# Altium project GatorSynth_Step_Sequencer.PrjPcb (part 1 of 2)
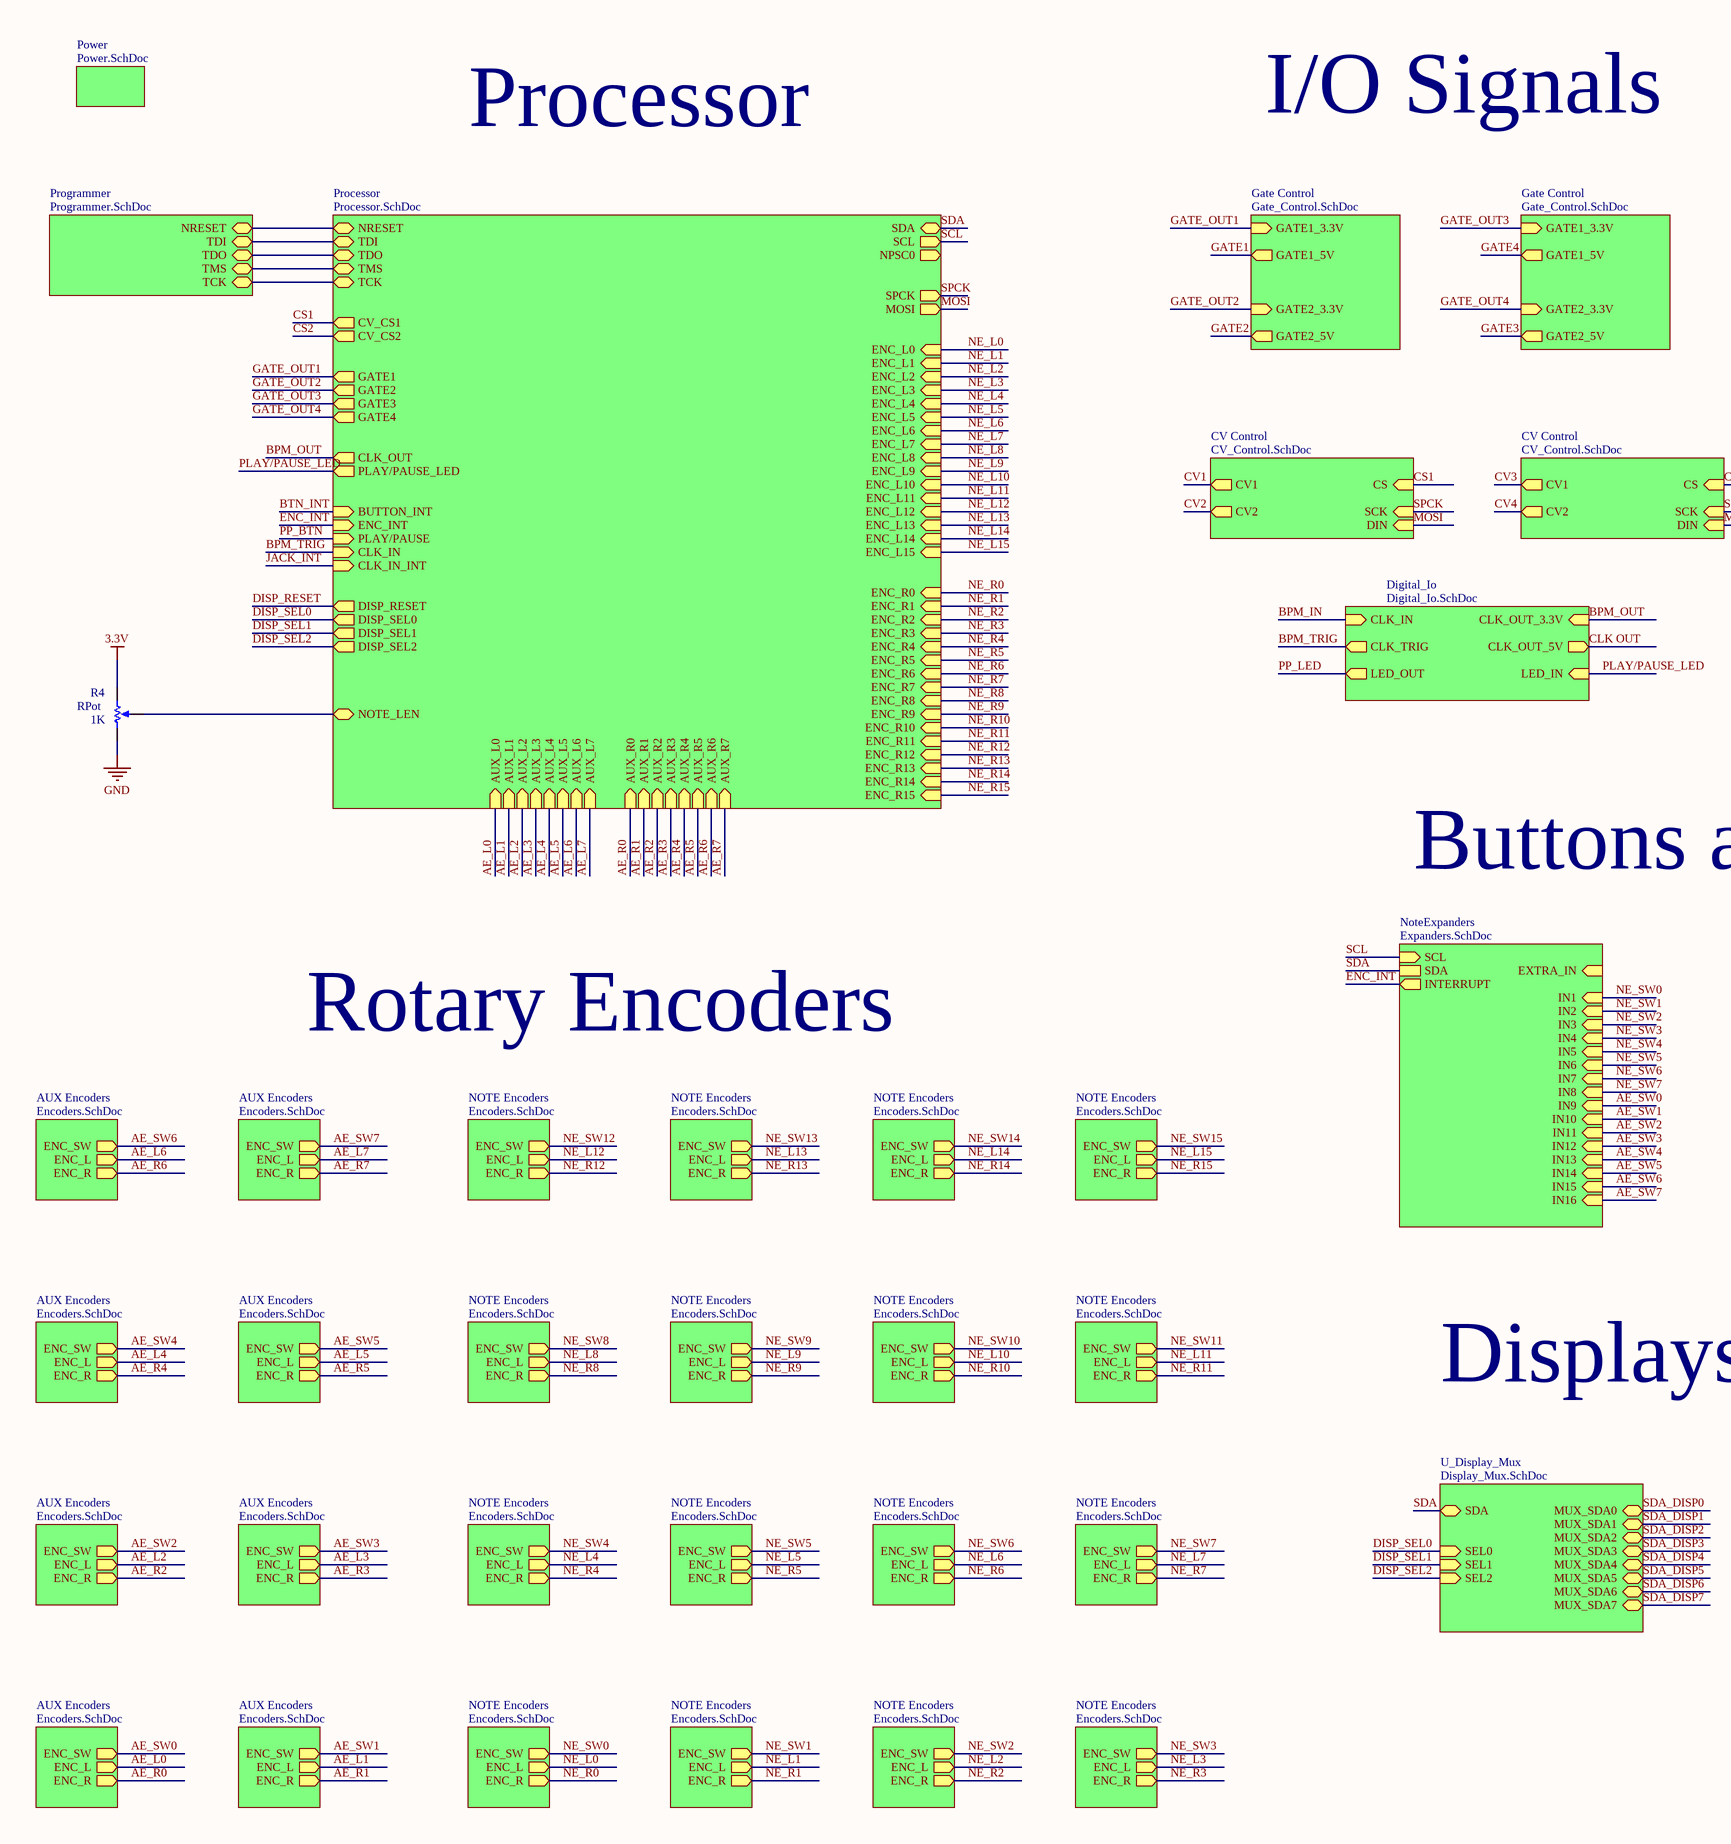
[diagram p0: Top_Level.SchDoc, left]
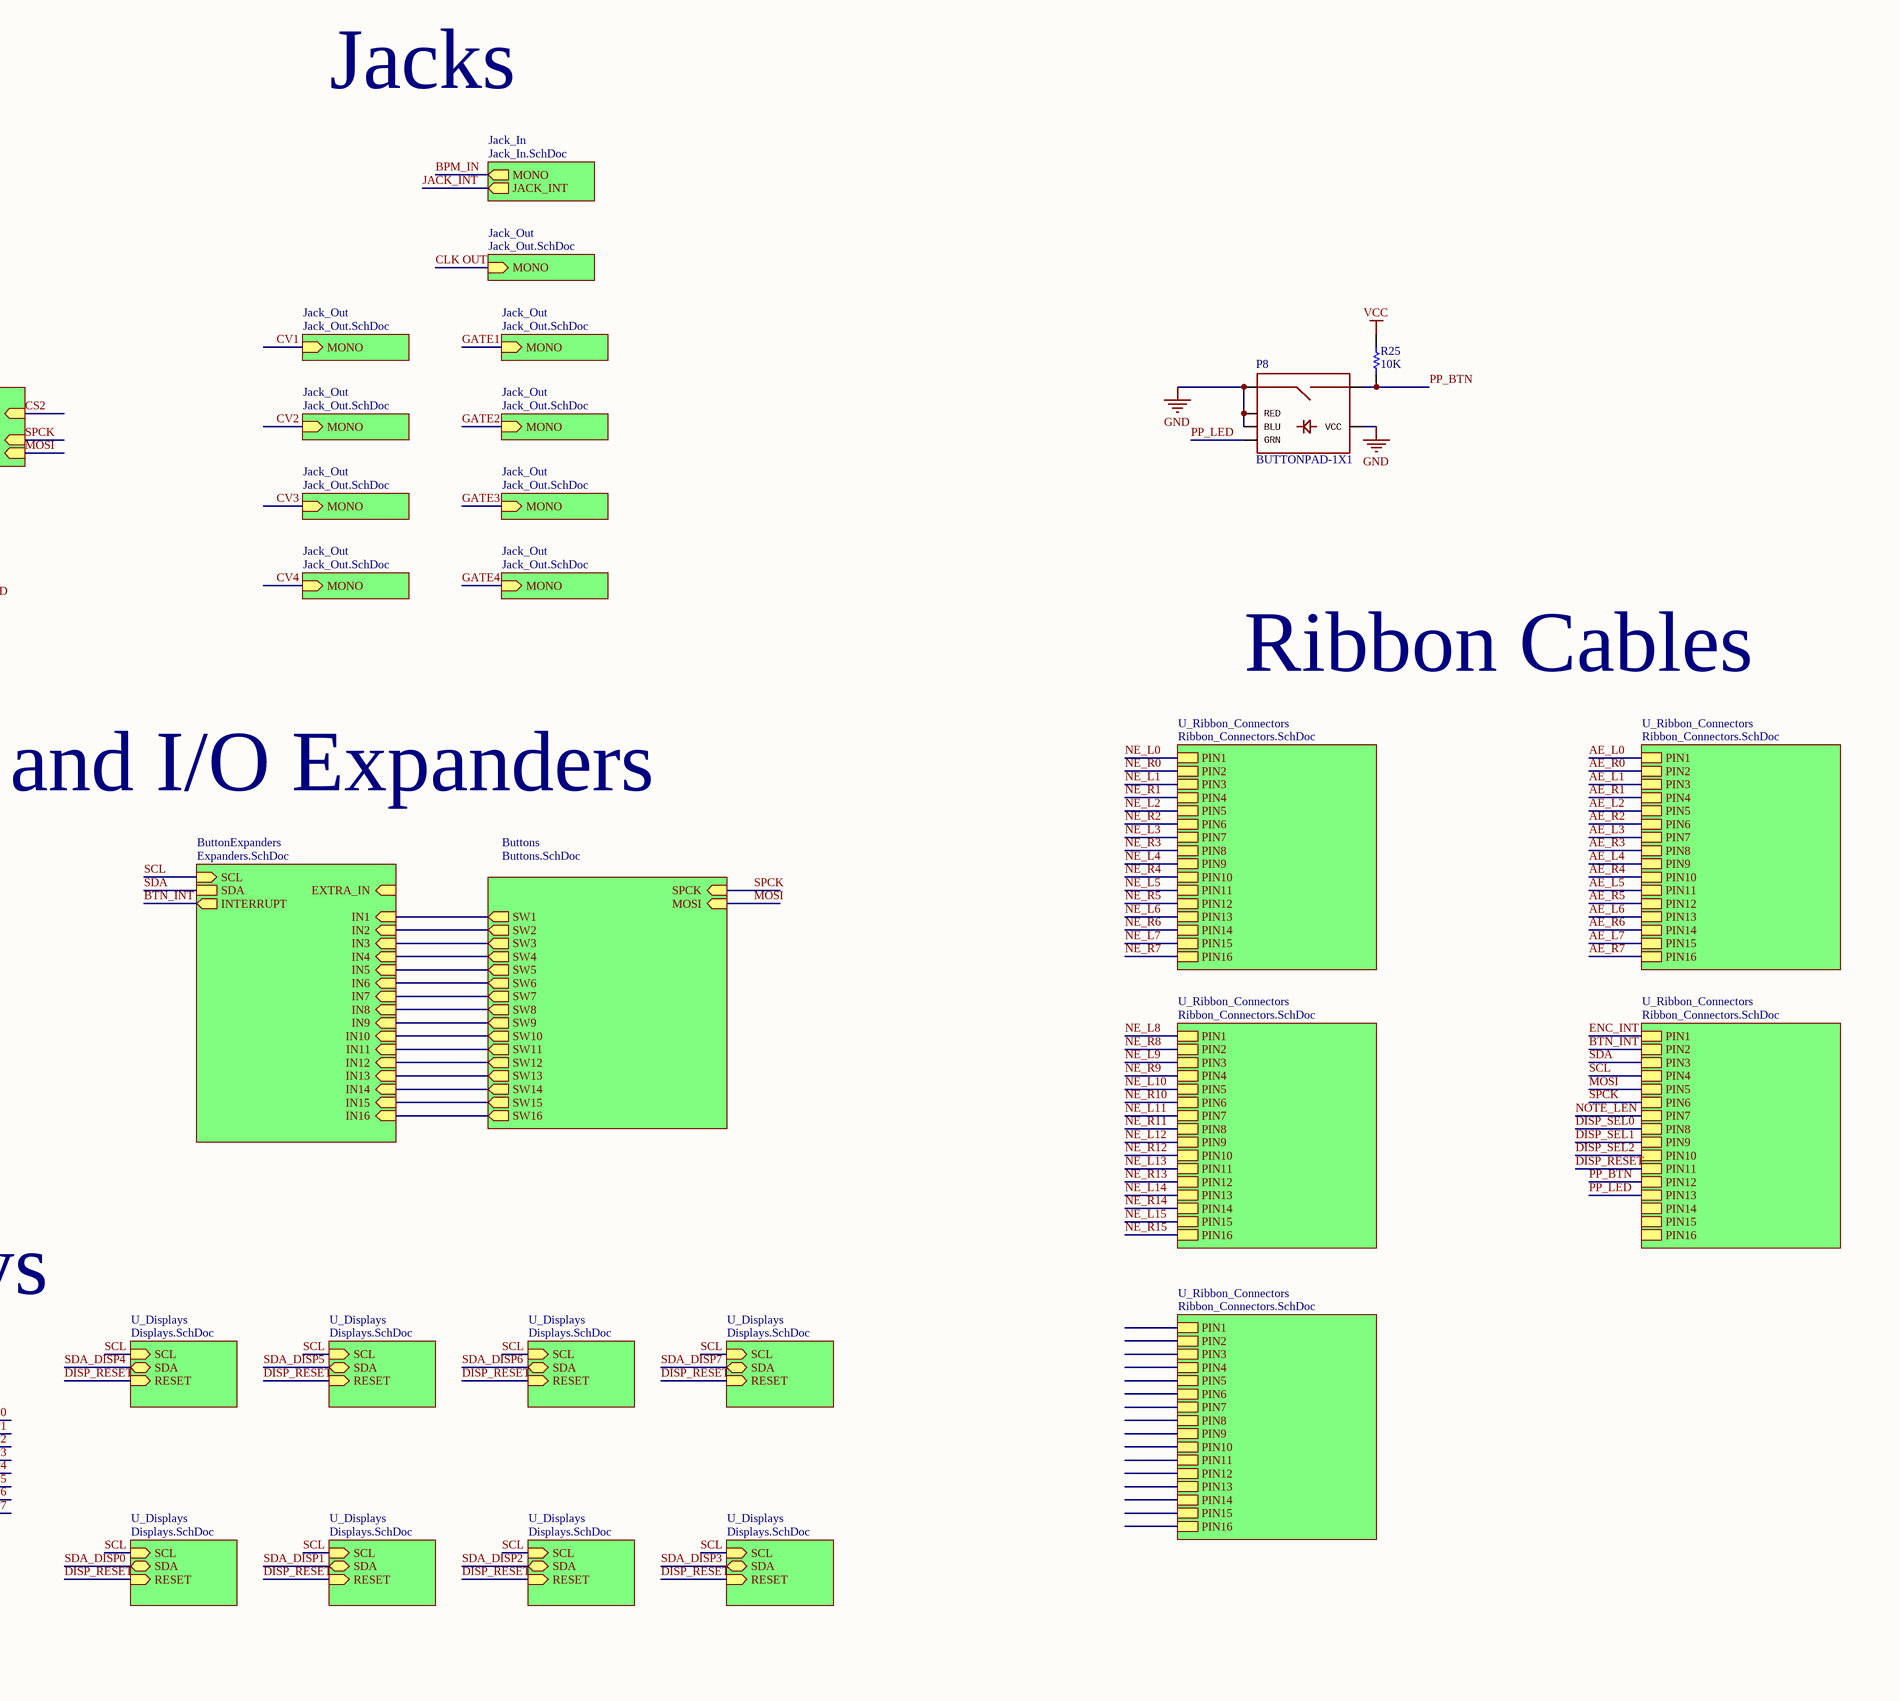
[diagram p1: Top_Level.SchDoc, right]
13 sheets, 398 parts. Net scope: hierarchical (ports join the sheet entries above them; power ports are global).
Board file: Gatorsynth_Sequencer.PcbDoc
Sheets:
  Top_Level.SchDoc
    Programmer = Programmer.SchDoc
    Gate Control = Gate_Control.SchDoc
    Processor = Processor.SchDoc
    Buttons = Buttons.SchDoc
    Jack_In = Jack_In.SchDoc
    Digital_Io = Digital_Io.SchDoc
    ButtonExpanders = Expanders.SchDoc
    NoteExpanders = Expanders.SchDoc
    Power = Power.SchDoc
    AUX Encoders = Encoders.SchDoc
    AUX Encoders = Encoders.SchDoc
    AUX Encoders = Encoders.SchDoc
    AUX Encoders = Encoders.SchDoc
    AUX Encoders = Encoders.SchDoc
    AUX Encoders = Encoders.SchDoc
    AUX Encoders = Encoders.SchDoc
    AUX Encoders = Encoders.SchDoc
    NOTE Encoders = Encoders.SchDoc
    NOTE Encoders = Encoders.SchDoc
    NOTE Encoders = Encoders.SchDoc
    NOTE Encoders = Encoders.SchDoc
    NOTE Encoders = Encoders.SchDoc
    NOTE Encoders = Encoders.SchDoc
    NOTE Encoders = Encoders.SchDoc
    NOTE Encoders = Encoders.SchDoc
    NOTE Encoders = Encoders.SchDoc
    NOTE Encoders = Encoders.SchDoc
    NOTE Encoders = Encoders.SchDoc
    NOTE Encoders = Encoders.SchDoc
    NOTE Encoders = Encoders.SchDoc
    NOTE Encoders = Encoders.SchDoc
    NOTE Encoders = Encoders.SchDoc
    NOTE Encoders = Encoders.SchDoc
    U_Displays = Displays.SchDoc
    U_Displays = Displays.SchDoc
    U_Displays = Displays.SchDoc
    U_Displays = Displays.SchDoc
    U_Displays = Displays.SchDoc
    U_Displays = Displays.SchDoc
    U_Displays = Displays.SchDoc
    U_Displays = Displays.SchDoc
    Gate Control = Gate_Control.SchDoc
    CV Control = CV_Control.SchDoc
    CV Control = CV_Control.SchDoc
    Jack_Out = Jack_Out.SchDoc
    Jack_Out = Jack_Out.SchDoc
    Jack_Out = Jack_Out.SchDoc
    Jack_Out = Jack_Out.SchDoc
    Jack_Out = Jack_Out.SchDoc
    Jack_Out = Jack_Out.SchDoc
    Jack_Out = Jack_Out.SchDoc
    Jack_Out = Jack_Out.SchDoc
    Jack_Out = Jack_Out.SchDoc

## Sheet Top_Level.SchDoc
size D

### Parts
(Parts that share a designator on the sheet are numbered #1, #2 ... from top to bottom, then left to right.)
P8#1  BUTTONPAD-1X1  [BUTTONPAD-1X1]
R4  RPot  value 1K  [POT inline wide]
R25#1  value 10K  [AXIAL-0.3]  (hidden comment: R3)

### Sub-sheets
AUX Encoders = Encoders.SchDoc: ENC_SW (out), ENC_L (out), ENC_R (out)
AUX Encoders = Encoders.SchDoc: ENC_SW (out), ENC_L (out), ENC_R (out)
AUX Encoders = Encoders.SchDoc: ENC_SW (out), ENC_L (out), ENC_R (out)
AUX Encoders = Encoders.SchDoc: ENC_SW (out), ENC_L (out), ENC_R (out)
AUX Encoders = Encoders.SchDoc: ENC_SW (out), ENC_L (out), ENC_R (out)
AUX Encoders = Encoders.SchDoc: ENC_SW (out), ENC_L (out), ENC_R (out)
AUX Encoders = Encoders.SchDoc: ENC_SW (out), ENC_L (out), ENC_R (out)
AUX Encoders = Encoders.SchDoc: ENC_SW (out), ENC_L (out), ENC_R (out)
ButtonExpanders = Expanders.SchDoc: SCL (in), SDA, EXTRA_IN (in), INTERRUPT (out), IN1 (in), IN2 (in), IN3 (in), IN4 (in), IN5 (in), IN6 (in), IN7 (in), IN8 (in), IN9 (in), IN10 (in), IN11 (in), IN12 (in), IN13 (in), IN14 (in), IN15 (in), IN16 (in)
Buttons = Buttons.SchDoc: SPCK (in), MOSI (in), SW1 (out), SW2 (out), SW3 (out), SW4 (out), SW5 (out), SW6 (out), SW7 (out), SW8 (out), SW9 (out), SW10 (out), SW11 (out), SW12 (out), SW13 (out), SW14 (out), SW15 (out), SW16 (out)
CV Control = CV_Control.SchDoc: CS (in), SCK (in), DIN (in), CV1 (out), CV2 (out)
CV Control = CV_Control.SchDoc: CS (in), SCK (in), DIN (in), CV1 (out), CV2 (out)
Digital_Io = Digital_Io.SchDoc: CLK_IN (in), CLK_TRIG (out), LED_IN (in), CLK_OUT_3.3V (in), CLK_OUT_5V (out), LED_OUT (out)
Gate Control = Gate_Control.SchDoc: GATE1_3.3V (in), GATE2_3.3V (in), GATE1_5V (out), GATE2_5V (out)
Gate Control = Gate_Control.SchDoc: GATE1_3.3V (in), GATE2_3.3V (in), GATE1_5V (out), GATE2_5V (out)
Jack_In = Jack_In.SchDoc: MONO (out), JACK_INT (out)
Jack_Out = Jack_Out.SchDoc: MONO (in)
Jack_Out = Jack_Out.SchDoc: MONO (in)
Jack_Out = Jack_Out.SchDoc: MONO (in)
Jack_Out = Jack_Out.SchDoc: MONO (in)
Jack_Out = Jack_Out.SchDoc: MONO (in)
Jack_Out = Jack_Out.SchDoc: MONO (in)
Jack_Out = Jack_Out.SchDoc: MONO (in)
Jack_Out = Jack_Out.SchDoc: MONO (in)
Jack_Out = Jack_Out.SchDoc: MONO (in)
NOTE Encoders = Encoders.SchDoc: ENC_SW (out), ENC_L (out), ENC_R (out)
NOTE Encoders = Encoders.SchDoc: ENC_SW (out), ENC_L (out), ENC_R (out)
NOTE Encoders = Encoders.SchDoc: ENC_SW (out), ENC_L (out), ENC_R (out)
NOTE Encoders = Encoders.SchDoc: ENC_SW (out), ENC_L (out), ENC_R (out)
NOTE Encoders = Encoders.SchDoc: ENC_SW (out), ENC_L (out), ENC_R (out)
NOTE Encoders = Encoders.SchDoc: ENC_SW (out), ENC_L (out), ENC_R (out)
NOTE Encoders = Encoders.SchDoc: ENC_SW (out), ENC_L (out), ENC_R (out)
NOTE Encoders = Encoders.SchDoc: ENC_SW (out), ENC_L (out), ENC_R (out)
NOTE Encoders = Encoders.SchDoc: ENC_SW (out), ENC_L (out), ENC_R (out)
NOTE Encoders = Encoders.SchDoc: ENC_SW (out), ENC_L (out), ENC_R (out)
NOTE Encoders = Encoders.SchDoc: ENC_SW (out), ENC_L (out), ENC_R (out)
NOTE Encoders = Encoders.SchDoc: ENC_SW (out), ENC_L (out), ENC_R (out)
NOTE Encoders = Encoders.SchDoc: ENC_SW (out), ENC_L (out), ENC_R (out)
NOTE Encoders = Encoders.SchDoc: ENC_SW (out), ENC_L (out), ENC_R (out)
NOTE Encoders = Encoders.SchDoc: ENC_SW (out), ENC_L (out), ENC_R (out)
NOTE Encoders = Encoders.SchDoc: ENC_SW (out), ENC_L (out), ENC_R (out)
NoteExpanders = Expanders.SchDoc: SCL (in), SDA, EXTRA_IN (in), INTERRUPT (out), IN1 (in), IN2 (in), IN3 (in), IN4 (in), IN5 (in), IN6 (in), IN7 (in), IN8 (in), IN9 (in), IN10 (in), IN11 (in), IN12 (in), IN13 (in), IN14 (in), IN15 (in), IN16 (in)
Power = Power.SchDoc: no entries
Processor = Processor.SchDoc: MOSI (out), SPCK (out), NPSC0 (out), SDA (bidir), SCL (out), NRESET (bidir), TDI (bidir), TDO (bidir), TMS (bidir), TCK (bidir), GATE1 (out), GATE2 (out), GATE3 (out), GATE4 (out), BUTTON_INT (in), ENC_INT (in), PLAY/PAUSE (in), CLK_IN (in), CLK_IN_INT (in), CLK_OUT (out), DISP_RESET (out), PLAY/PAUSE_LED (out), CV_CS2 (out), CV_CS1 (out), AUX_L0 (in), AUX_L1 (in), AUX_L2 (in), AUX_L3 (in), AUX_L4 (in), AUX_L5 (in), AUX_L6 (in), AUX_L7 (in), AUX_R0 (in), AUX_R1 (in), AUX_R2 (in), AUX_R3 (in), AUX_R4 (in), AUX_R5 (in), AUX_R6 (in), AUX_R7 (in), DISP_SEL0 (out), DISP_SEL1 (out), DISP_SEL2 (out), ENC_L0 (in), ENC_L1 (in), ENC_L2 (in), ENC_L3 (in), ENC_L4 (in), ENC_L5 (in), ENC_L6 (in), ENC_L7 (in), ENC_L8 (in), ENC_L9 (in), ENC_L10 (in), ENC_L11 (in), ENC_L12 (in), ENC_L13 (in), ENC_L14 (in), ENC_L15 (in), ENC_R0 (in), ENC_R1 (in), ENC_R2 (in), ENC_R3 (in), ENC_R4 (in), ENC_R5 (in), ENC_R6 (in), ENC_R7 (in), ENC_R8 (in), ENC_R9 (in), ENC_R10 (in), ENC_R11 (in), ENC_R12 (in), ENC_R13 (in), ENC_R14 (in), ENC_R15 (in), NOTE_LEN
Programmer = Programmer.SchDoc: TMS (bidir), TCK (bidir), TDO (bidir), TDI (bidir), NRESET (bidir)
U_Display_Mux = Display_Mux.SchDoc (file not in this document): SEL1 (in), SEL2 (in), MUX_SDA0 (bidir), MUX_SDA1 (bidir), MUX_SDA2 (bidir), MUX_SDA3 (bidir), MUX_SDA4 (bidir), MUX_SDA5 (bidir), MUX_SDA6 (bidir), MUX_SDA7 (bidir), SDA (bidir), SEL0 (in)
U_Displays = Displays.SchDoc: SCL (in), SDA (bidir), RESET (in)
U_Displays = Displays.SchDoc: SCL (in), SDA (bidir), RESET (in)
U_Displays = Displays.SchDoc: SCL (in), SDA (bidir), RESET (in)
U_Displays = Displays.SchDoc: SCL (in), SDA (bidir), RESET (in)
U_Displays = Displays.SchDoc: SCL (in), SDA (bidir), RESET (in)
U_Displays = Displays.SchDoc: SCL (in), SDA (bidir), RESET (in)
U_Displays = Displays.SchDoc: SCL (in), SDA (bidir), RESET (in)
U_Displays = Displays.SchDoc: SCL (in), SDA (bidir), RESET (in)
U_Ribbon_Connectors = Ribbon_Connectors.SchDoc (file not in this document): PIN1, PIN2, PIN3, PIN4, PIN5, PIN6, PIN7, PIN8, PIN9, PIN10, PIN11, PIN12, PIN13, PIN14, PIN15, PIN16
U_Ribbon_Connectors = Ribbon_Connectors.SchDoc (file not in this document): PIN1, PIN2, PIN3, PIN4, PIN5, PIN6, PIN7, PIN8, PIN9, PIN10, PIN11, PIN12, PIN13, PIN14, PIN15, PIN16
U_Ribbon_Connectors = Ribbon_Connectors.SchDoc (file not in this document): PIN1, PIN2, PIN3, PIN4, PIN5, PIN6, PIN7, PIN8, PIN9, PIN10, PIN11, PIN12, PIN13, PIN14, PIN15, PIN16
U_Ribbon_Connectors = Ribbon_Connectors.SchDoc (file not in this document): PIN1, PIN2, PIN3, PIN4, PIN5, PIN6, PIN7, PIN8, PIN9, PIN10, PIN11, PIN12, PIN13, PIN14, PIN15, PIN16
U_Ribbon_Connectors = Ribbon_Connectors.SchDoc (file not in this document): PIN1, PIN2, PIN3, PIN4, PIN5, PIN6, PIN7, PIN8, PIN9, PIN10, PIN11, PIN12, PIN13, PIN14, PIN15, PIN16

### Nets
3.3V: R4.2(BOT)
GND: P8#1.BLU1(BLU) P8#1.RED1(RED) P8#1.SIG1 P8#1.VCC1(VCC) R4.1(TOP)
VCC: R25#1.2
AE_L0: sheet Processor/AUX_L0, sheet AUX Encoders/ENC_L, sheet U_Ribbon_Connectors/PIN1
AE_L1: sheet Processor/AUX_L1, sheet AUX Encoders/ENC_L, sheet U_Ribbon_Connectors/PIN3
AE_L2: sheet Processor/AUX_L2, sheet AUX Encoders/ENC_L, sheet U_Ribbon_Connectors/PIN5
AE_L3: sheet Processor/AUX_L3, sheet AUX Encoders/ENC_L, sheet U_Ribbon_Connectors/PIN7
AE_L4: sheet Processor/AUX_L4, sheet AUX Encoders/ENC_L, sheet U_Ribbon_Connectors/PIN9
AE_L5: sheet Processor/AUX_L5, sheet AUX Encoders/ENC_L, sheet U_Ribbon_Connectors/PIN11
AE_L6: sheet Processor/AUX_L6, sheet AUX Encoders/ENC_L, sheet U_Ribbon_Connectors/PIN13
AE_L7: sheet Processor/AUX_L7, sheet AUX Encoders/ENC_L, sheet U_Ribbon_Connectors/PIN15
AE_R0: sheet Processor/AUX_R0, sheet AUX Encoders/ENC_R, sheet U_Ribbon_Connectors/PIN2
AE_R1: sheet Processor/AUX_R1, sheet AUX Encoders/ENC_R, sheet U_Ribbon_Connectors/PIN4
AE_R2: sheet Processor/AUX_R2, sheet AUX Encoders/ENC_R, sheet U_Ribbon_Connectors/PIN6
AE_R3: sheet Processor/AUX_R3, sheet AUX Encoders/ENC_R, sheet U_Ribbon_Connectors/PIN8
AE_R4: sheet Processor/AUX_R4, sheet AUX Encoders/ENC_R, sheet U_Ribbon_Connectors/PIN10
AE_R5: sheet Processor/AUX_R5, sheet AUX Encoders/ENC_R, sheet U_Ribbon_Connectors/PIN12
AE_R6: sheet Processor/AUX_R6, sheet AUX Encoders/ENC_R, sheet U_Ribbon_Connectors/PIN14
AE_R7: sheet Processor/AUX_R7, sheet AUX Encoders/ENC_R, sheet U_Ribbon_Connectors/PIN16
AE_SW0: sheet NoteExpanders/IN9, sheet AUX Encoders/ENC_SW
AE_SW1: sheet NoteExpanders/IN10, sheet AUX Encoders/ENC_SW
AE_SW2: sheet NoteExpanders/IN11, sheet AUX Encoders/ENC_SW
AE_SW3: sheet NoteExpanders/IN12, sheet AUX Encoders/ENC_SW
AE_SW4: sheet NoteExpanders/IN13, sheet AUX Encoders/ENC_SW
AE_SW5: sheet NoteExpanders/IN14, sheet AUX Encoders/ENC_SW
AE_SW6: sheet NoteExpanders/IN15, sheet AUX Encoders/ENC_SW
AE_SW7: sheet NoteExpanders/IN16, sheet AUX Encoders/ENC_SW
BPM_IN: sheet Jack_In/MONO, sheet Digital_Io/CLK_IN
BPM_OUT: sheet Processor/CLK_OUT, sheet Digital_Io/CLK_OUT_3.3V
BPM_TRIG: sheet Processor/CLK_IN, sheet Digital_Io/CLK_TRIG
BTN_INT: sheet Processor/BUTTON_INT, sheet ButtonExpanders/INTERRUPT, sheet U_Ribbon_Connectors/PIN2
CLK OUT: sheet Digital_Io/CLK_OUT_5V, sheet Jack_Out/MONO
CS1: sheet Processor/CV_CS1, sheet CV Control/CS
CS2: sheet Processor/CV_CS2, sheet CV Control/CS
CV1: sheet CV Control/CV1, sheet Jack_Out/MONO
CV2: sheet CV Control/CV2, sheet Jack_Out/MONO
CV3: sheet CV Control/CV1, sheet Jack_Out/MONO
CV4: sheet CV Control/CV2, sheet Jack_Out/MONO
DISP_RESET: sheet Processor/DISP_RESET, sheet U_Displays/RESET, sheet U_Displays/RESET, sheet U_Displays/RESET, sheet U_Displays/RESET, sheet U_Displays/RESET, sheet U_Displays/RESET, sheet U_Displays/RESET, sheet U_Displays/RESET, sheet U_Ribbon_Connectors/PIN11
DISP_SEL0: sheet Processor/DISP_SEL0, sheet U_Display_Mux/SEL0, sheet U_Ribbon_Connectors/PIN8
DISP_SEL1: sheet Processor/DISP_SEL1, sheet U_Display_Mux/SEL1, sheet U_Ribbon_Connectors/PIN9
DISP_SEL2: sheet Processor/DISP_SEL2, sheet U_Display_Mux/SEL2, sheet U_Ribbon_Connectors/PIN10
ENC_INT: sheet Processor/ENC_INT, sheet NoteExpanders/INTERRUPT, sheet U_Ribbon_Connectors/PIN1
GATE1: sheet Gate Control/GATE1_5V, sheet Jack_Out/MONO
GATE2: sheet Gate Control/GATE2_5V, sheet Jack_Out/MONO
GATE3: sheet Gate Control/GATE2_5V, sheet Jack_Out/MONO
GATE4: sheet Gate Control/GATE1_5V, sheet Jack_Out/MONO
GATE_OUT1: sheet Processor/GATE1, sheet Gate Control/GATE1_3.3V
GATE_OUT2: sheet Processor/GATE2, sheet Gate Control/GATE2_3.3V
GATE_OUT3: sheet Gate Control/GATE1_3.3V, sheet Processor/GATE3
GATE_OUT4: sheet Gate Control/GATE2_3.3V, sheet Processor/GATE4
JACK_INT: sheet Processor/CLK_IN_INT, sheet Jack_In/JACK_INT
MOSI: sheet Processor/MOSI, sheet Buttons/MOSI, sheet CV Control/DIN, sheet CV Control/DIN, sheet U_Ribbon_Connectors/PIN5
NE_L0: sheet Processor/ENC_L0, sheet NOTE Encoders/ENC_L, sheet U_Ribbon_Connectors/PIN1
NE_L1: sheet Processor/ENC_L1, sheet NOTE Encoders/ENC_L, sheet U_Ribbon_Connectors/PIN3
NE_L2: sheet Processor/ENC_L2, sheet NOTE Encoders/ENC_L, sheet U_Ribbon_Connectors/PIN5
NE_L3: sheet Processor/ENC_L3, sheet NOTE Encoders/ENC_L, sheet U_Ribbon_Connectors/PIN7
NE_L4: sheet Processor/ENC_L4, sheet NOTE Encoders/ENC_L, sheet U_Ribbon_Connectors/PIN9
NE_L5: sheet Processor/ENC_L5, sheet NOTE Encoders/ENC_L, sheet U_Ribbon_Connectors/PIN11
NE_L6: sheet Processor/ENC_L6, sheet NOTE Encoders/ENC_L, sheet U_Ribbon_Connectors/PIN13
NE_L7: sheet Processor/ENC_L7, sheet NOTE Encoders/ENC_L, sheet U_Ribbon_Connectors/PIN15
NE_L8: sheet Processor/ENC_L8, sheet NOTE Encoders/ENC_L, sheet U_Ribbon_Connectors/PIN1
NE_L9: sheet Processor/ENC_L9, sheet NOTE Encoders/ENC_L, sheet U_Ribbon_Connectors/PIN3
NE_L10: sheet Processor/ENC_L10, sheet NOTE Encoders/ENC_L, sheet U_Ribbon_Connectors/PIN5
NE_L11: sheet Processor/ENC_L11, sheet NOTE Encoders/ENC_L, sheet U_Ribbon_Connectors/PIN7
NE_L12: sheet Processor/ENC_L12, sheet NOTE Encoders/ENC_L, sheet U_Ribbon_Connectors/PIN9
NE_L13: sheet Processor/ENC_L13, sheet NOTE Encoders/ENC_L, sheet U_Ribbon_Connectors/PIN11
NE_L14: sheet Processor/ENC_L14, sheet NOTE Encoders/ENC_L, sheet U_Ribbon_Connectors/PIN13
NE_L15: sheet Processor/ENC_L15, sheet NOTE Encoders/ENC_L, sheet U_Ribbon_Connectors/PIN15
NE_R0: sheet Processor/ENC_R0, sheet NOTE Encoders/ENC_R, sheet U_Ribbon_Connectors/PIN2
NE_R1: sheet Processor/ENC_R1, sheet NOTE Encoders/ENC_R, sheet U_Ribbon_Connectors/PIN4
NE_R2: sheet Processor/ENC_R2, sheet NOTE Encoders/ENC_R, sheet U_Ribbon_Connectors/PIN6
NE_R3: sheet Processor/ENC_R3, sheet NOTE Encoders/ENC_R, sheet U_Ribbon_Connectors/PIN8
NE_R4: sheet Processor/ENC_R4, sheet NOTE Encoders/ENC_R, sheet U_Ribbon_Connectors/PIN10
NE_R5: sheet Processor/ENC_R5, sheet NOTE Encoders/ENC_R, sheet U_Ribbon_Connectors/PIN12
NE_R6: sheet Processor/ENC_R6, sheet NOTE Encoders/ENC_R, sheet U_Ribbon_Connectors/PIN14
NE_R7: sheet Processor/ENC_R7, sheet NOTE Encoders/ENC_R, sheet U_Ribbon_Connectors/PIN16
NE_R8: sheet Processor/ENC_R8, sheet NOTE Encoders/ENC_R, sheet U_Ribbon_Connectors/PIN2
NE_R9: sheet Processor/ENC_R9, sheet NOTE Encoders/ENC_R, sheet U_Ribbon_Connectors/PIN4
NE_R10: sheet Processor/ENC_R10, sheet NOTE Encoders/ENC_R, sheet U_Ribbon_Connectors/PIN6
NE_R11: sheet Processor/ENC_R11, sheet NOTE Encoders/ENC_R, sheet U_Ribbon_Connectors/PIN8
NE_R12: sheet Processor/ENC_R12, sheet NOTE Encoders/ENC_R, sheet U_Ribbon_Connectors/PIN10
NE_R13: sheet Processor/ENC_R13, sheet NOTE Encoders/ENC_R, sheet U_Ribbon_Connectors/PIN12
NE_R14: sheet Processor/ENC_R14, sheet NOTE Encoders/ENC_R, sheet U_Ribbon_Connectors/PIN14
NE_R15: sheet Processor/ENC_R15, sheet NOTE Encoders/ENC_R, sheet U_Ribbon_Connectors/PIN16
NE_SW0: sheet NoteExpanders/IN1, sheet NOTE Encoders/ENC_SW
NE_SW1: sheet NoteExpanders/IN2, sheet NOTE Encoders/ENC_SW
NE_SW2: sheet NoteExpanders/IN3, sheet NOTE Encoders/ENC_SW
NE_SW3: sheet NoteExpanders/IN4, sheet NOTE Encoders/ENC_SW
NE_SW4: sheet NoteExpanders/IN5, sheet NOTE Encoders/ENC_SW
NE_SW5: sheet NoteExpanders/IN6, sheet NOTE Encoders/ENC_SW
NE_SW6: sheet NoteExpanders/IN7, sheet NOTE Encoders/ENC_SW
NE_SW7: sheet NoteExpanders/IN8, sheet NOTE Encoders/ENC_SW
NOTE_LEN: sheet U_Ribbon_Connectors/PIN7
PLAY/PAUSE_LED: sheet Processor/PLAY/PAUSE_LED, sheet Digital_Io/LED_IN
PP_BTN: P8#1.SIG2 R25#1.1 ; sheet Processor/PLAY/PAUSE, sheet U_Ribbon_Connectors/PIN12
PP_LED: P8#1.GRN1(GRN) ; sheet Digital_Io/LED_OUT, sheet U_Ribbon_Connectors/PIN13
SCL: sheet Processor/SCL, sheet ButtonExpanders/SCL, sheet NoteExpanders/SCL, sheet U_Displays/SCL, sheet U_Displays/SCL, sheet U_Displays/SCL, sheet U_Displays/SCL, sheet U_Displays/SCL, sheet U_Displays/SCL, sheet U_Displays/SCL, sheet U_Displays/SCL, sheet U_Ribbon_Connectors/PIN4
SDA: sheet Processor/SDA, sheet ButtonExpanders/SDA, sheet NoteExpanders/SDA, sheet U_Display_Mux/SDA, sheet U_Ribbon_Connectors/PIN3
SDA_DISP0: sheet U_Display_Mux/MUX_SDA0, sheet U_Displays/SDA  [project net SDA_CPU_U_Displays]
SDA_DISP1: sheet U_Display_Mux/MUX_SDA1, sheet U_Displays/SDA  [project net SDA_CPU_U_Displays]
SDA_DISP2: sheet U_Display_Mux/MUX_SDA2, sheet U_Displays/SDA  [project net SDA_CPU_U_Displays]
SDA_DISP3: sheet U_Display_Mux/MUX_SDA3, sheet U_Displays/SDA  [project net SDA_CPU_U_Displays]
SDA_DISP4: sheet U_Display_Mux/MUX_SDA4, sheet U_Displays/SDA  [project net SDA_CPU_U_Displays]
SDA_DISP5: sheet U_Display_Mux/MUX_SDA5, sheet U_Displays/SDA  [project net SDA_CPU_U_Displays]
SDA_DISP6: sheet U_Display_Mux/MUX_SDA6, sheet U_Displays/SDA  [project net SDA_CPU_U_Displays]
SDA_DISP7: sheet U_Display_Mux/MUX_SDA7, sheet U_Displays/SDA  [project net SDA_CPU_U_Displays]
SPCK: sheet Processor/SPCK, sheet Buttons/SPCK, sheet CV Control/SCK, sheet CV Control/SCK, sheet U_Ribbon_Connectors/PIN6
SW1: sheet Buttons/SW1, sheet ButtonExpanders/IN1
SW2: sheet Buttons/SW2, sheet ButtonExpanders/IN2
SW3: sheet Buttons/SW3, sheet ButtonExpanders/IN3
SW4: sheet Buttons/SW4, sheet ButtonExpanders/IN4
SW5: sheet Buttons/SW5, sheet ButtonExpanders/IN5
SW6: sheet Buttons/SW6, sheet ButtonExpanders/IN6
SW7: sheet Buttons/SW7, sheet ButtonExpanders/IN7
SW8: sheet Buttons/SW8, sheet ButtonExpanders/IN8
SW9: sheet Buttons/SW9, sheet ButtonExpanders/IN9
SW10: sheet Buttons/SW10, sheet ButtonExpanders/IN10
SW11: sheet Buttons/SW11, sheet ButtonExpanders/IN11
SW12: sheet Buttons/SW12, sheet ButtonExpanders/IN12
SW13: sheet Buttons/SW13, sheet ButtonExpanders/IN13
SW14: sheet Buttons/SW14, sheet ButtonExpanders/IN14
SW15: sheet Buttons/SW15, sheet ButtonExpanders/IN15
SW16: sheet Buttons/SW16, sheet ButtonExpanders/IN16
NetJ4_2: sheet Programmer/TMS, sheet Processor/TMS
NetJ4_4: sheet Programmer/TCK, sheet Processor/TCK
NetJ4_6: sheet Programmer/TDO, sheet Processor/TDO
NetJ4_8: sheet Programmer/TDI, sheet Processor/TDI
NetJ4_10: sheet Programmer/NRESET, sheet Processor/NRESET
NetR4_3: R4.3(TAP) ; sheet Processor/NOTE_LEN

### Notes on the sheet
- Processor
- I/O Signals
- Jacks
- Ribbon Cables
- Buttons and I/O Expanders
- Rotary Encoders
- Displays

### Library data of the parts
R4 = RPot: Potentiometer; Sim Note: Enter the Resistance value and the set point into parameter fields.; Set Position: 0.5; Published: 8-Jun-2000; LatestRevisionDate: 17-Jul-2002; LatestRevisionNote: Re-released for DXP Platform.; PackageReference: VR5; Publisher: Altium Limited; PackageDescription: Variable Resistor, Thru-Hole; 3 Leads
R25#1 = Res1: Resistor; Published: 8-Jun-2000; LatestRevisionDate: 17-Jul-2002; LatestRevisionNote: Re-released for DXP Platform.; PackageReference: AXIAL-0.3; Publisher: Altium Limited; PackageDescription: Axial Device, Thru-Hole; 2 Leads; 0.3 in Pin Spacing

## Sheet Programmer.SchDoc
size Letter
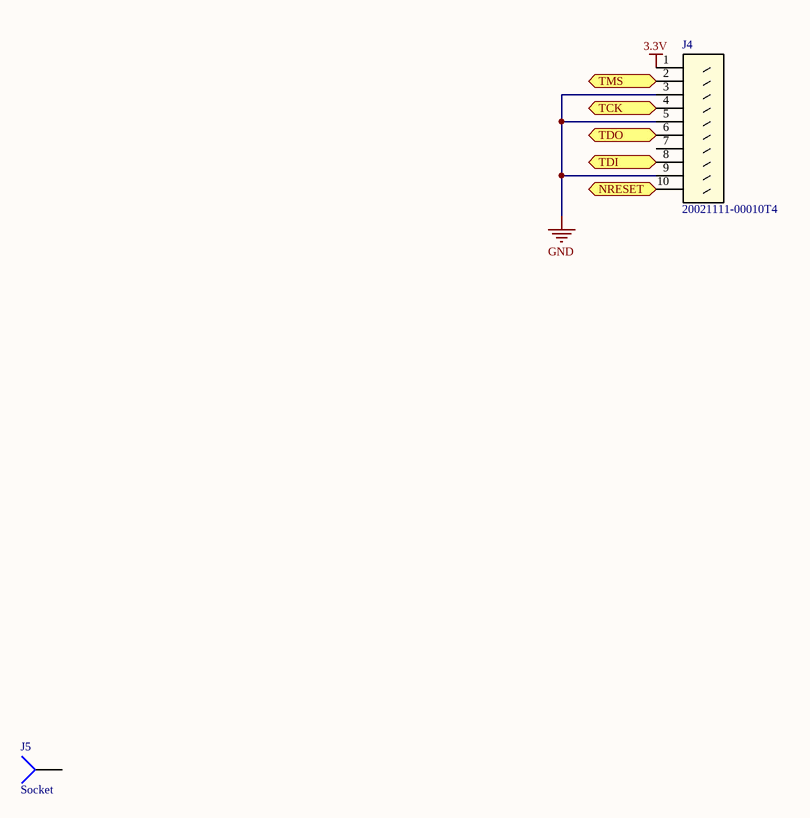
[diagram p2: Programmer.SchDoc]

### Parts
J4  20021111-00010T4  [CONN_MINITEK_2X5]
J5  Socket  [PIN1]

### Ports
NRESET (bidir), TCK (bidir), TDI (bidir), TDO (bidir), TMS (bidir)

### Nets
3.3V: J4.1
GND: J4.3 J4.5 J4.9
NetJ4_2: J4.2 ; port TMS
NetJ4_4: J4.4 ; port TCK
NetJ4_6: J4.6 ; port TDO
NetJ4_8: J4.8 ; port TDI
NetJ4_10: J4.10 ; port NRESET

Not connected (* = marked no-connect by the designer): J4 7; J5 1

### Library data of the parts
J4 = 20021111-00010T4: Imported; Manufacturer_Part_Number: 20021111-00010T4LF; Vendor: FCI; C: Copyright (C) 2015 Accelerated Designs. All rights reserved; Copyright: Copyright (C) 2015 Accelerated Designs. All rights reserved; Value: Value; Type: Type; RefDes: RefDes
J5 = Socket: LatestRevisionDate: 17-Jul-2002; LatestRevisionNote: Re-released for DXP Platform.; Publisher: Altium Limited

## Sheet Gate_Control.SchDoc
size Letter
Used 2 times, as channels Gate Control, Gate Control. Parts and nets are listed once, with the designators drawn on the sheet.
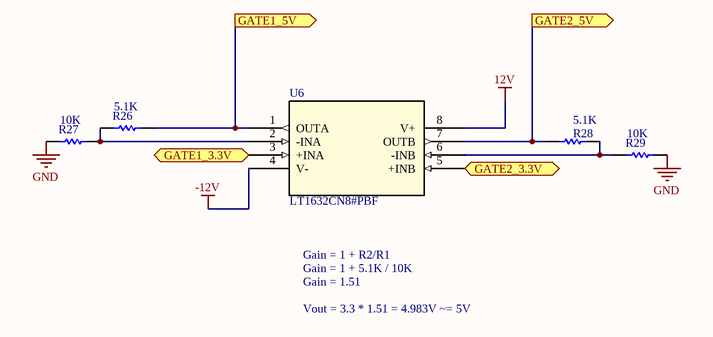
[diagram p3: Gate_Control.SchDoc]

### Parts
R26  value 5.1K  [AXIAL-0.3]  (hidden comment: Res1)
R27  value 10K  [AXIAL-0.3]  (hidden comment: Res1)
R28  value 5.1K  [AXIAL-0.3]  (hidden comment: Res1)
R29  value 10K  [AXIAL-0.3]  (hidden comment: Res1)
U6  LT1632CN8#PBF  [PDIP-8_N]

### Ports
GATE1_3.3V (in), GATE1_5V (out), GATE2_3.3V (in), GATE2_5V (out)

### Nets
12V: U6.8(V+)
-12V: U6.4(V-)
GND: R27.1 R29.2
GATE1_3.3V: U6.3(+INA) ; port GATE1_3.3V
GATE1_5V: R26.2 U6.1(OUTA) ; port GATE1_5V
GATE2_3.3V: U6.5(+INB) ; port GATE2_3.3V
GATE2_5V: R28.1 U6.7(OUTB) ; port GATE2_5V
NetR26_1: R26.1 R27.2 U6.2(-INA)
NetR28_2: R28.2 R29.1 U6.6(-INB)

### Channels
Gate Control: designators R26=R19_Gate_Control2 R27=R20_Gate_Control2 R28=R21_Gate_Control2 R29=R22_Gate_Control2 U6=U4_Gate_Control2; ports GATE1_3.3V=GATE_OUT3 GATE1_5V=GATE4 GATE2_3.3V=GATE_OUT4 GATE2_5V=GATE3
Gate Control: designators R26=R19_Gate_Control1 R27=R20_Gate_Control1 R28=R21_Gate_Control1 R29=R22_Gate_Control1 U6=U4_Gate_Control1; ports GATE1_3.3V=GATE_OUT1 GATE1_5V=GATE1 GATE2_3.3V=GATE_OUT2 GATE2_5V=GATE2

### Notes on the sheet
- Gain = 1 + R2/R1
- Gain = 1 + 5.1K / 10K
- Gain = 1.51
- Vout = 3.3 * 1.51 = 4.983V ~= 5V

### Library data of the parts
R26-R29 = Res1: Resistor; Published: 8-Jun-2000; LatestRevisionDate: 17-Jul-2002; LatestRevisionNote: Re-released for DXP Platform.; PackageReference: AXIAL-0.3; Publisher: Altium Limited; PackageDescription: Axial Device, Thru-Hole; 2 Leads; 0.3 in Pin Spacing
U6 = LT1632CN8#PBF: Imported; Operating_Temperature: 0Â°C ~ 70Â°C; Current_-_Output_/_Channel: 70mA; Voltage_-_Input_Offset: 500ÂµV; Current_-_Input_Bias: 1.15ÂµA; Output_Type: Rail-to-Rail; Vendor: Linear Technology; Amplifier_Type: General Purpose; Number_of_Circuits: 2; Slew_Rate: 45 V/Âµs; Gain_Bandwidth_Product: 45MHz; Current_-_Supply: 4.6mA; Current_-_Output/Channel: 40mA; Voltage_-_Supply,_Single/Dual_(Â±): 2.7 V ~ 36 V, Â±1.35 V ~ 18 V; Mounting_Type: Through Hole; 3D_Library_Name: Maxim2; C: Copyright (C) 2016 Accelerated Designs. All rights reserved; -3db_Bandwidth: -; Series: *; Manufacturer_Part_Number: LT1632CN8#PBF; DigiKeyPartNumber: LT1632CN8-ND; Quantity_Available: 0; DataSheet: http://www.linear.com/docs/3055; Packaging: Tube; Package_/_Case: 8-DIP (0.300", 7.62mm); Copyright: Copyright (C) 2015 Accelerated Designs. All rights reserved; Supplier_Device_Package: 8-PDIP; Value: Value; Type: Type; RefDes: RefDes

## Sheet Processor.SchDoc
size C
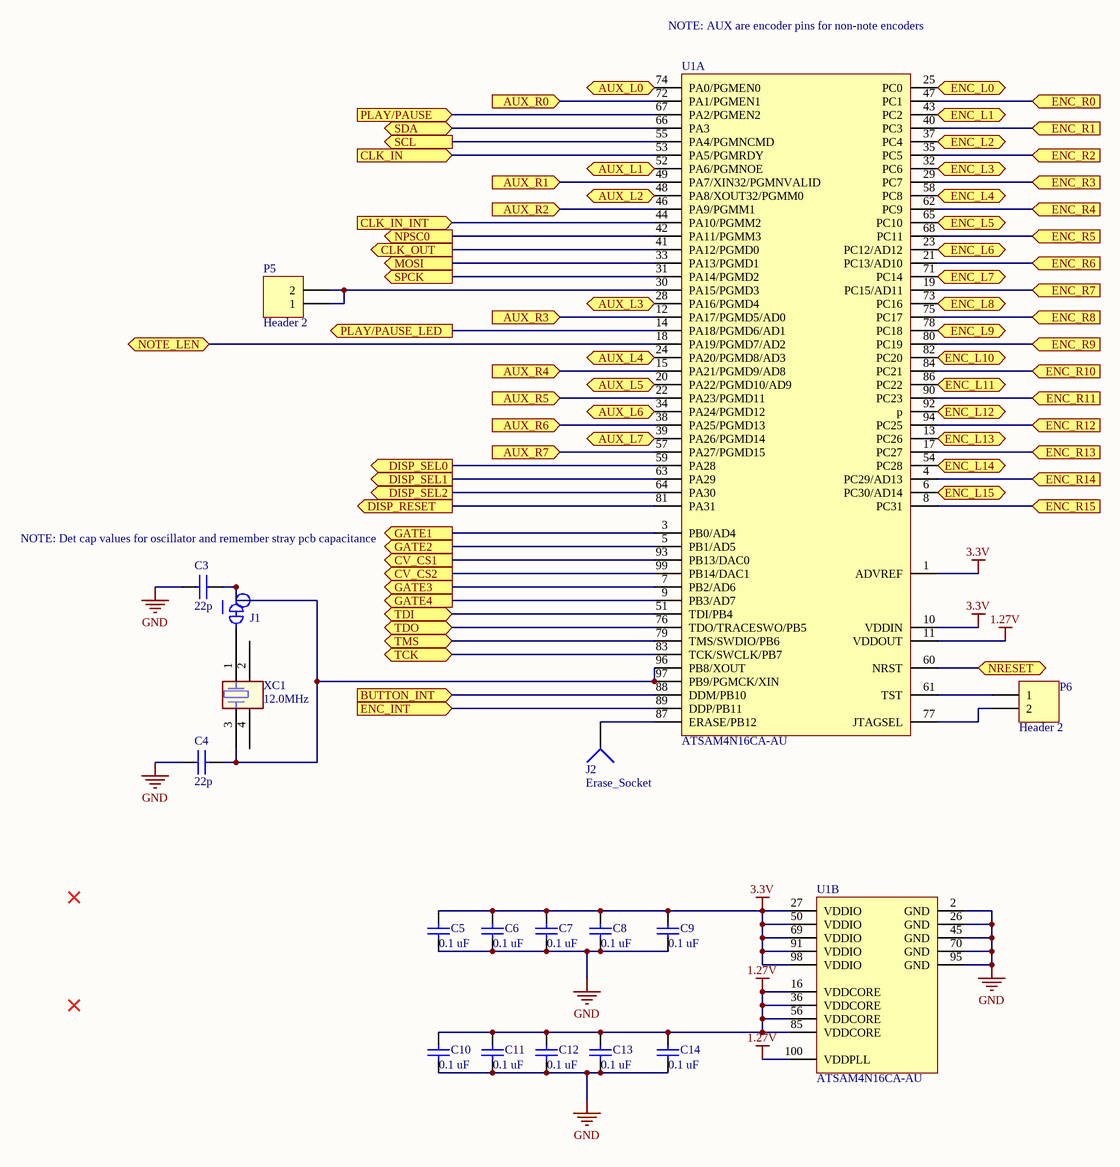
[diagram p4: Processor.SchDoc]

### Parts
C3  value 22p  [AP1-00001]  (hidden comment: CAP-NONPOL)
C4  value 22p  [AP1-00001]  (hidden comment: CAP-NONPOL)
C5  value 0.1 uF  [C0805]
C6  value 0.1 uF  [C0805]
C7  value 0.1 uF  [C0805]
C8  value 0.1 uF  [C0805]
C9  value 0.1 uF  [C0805]
C10  value 0.1 uF  [C0805]
C11  value 0.1 uF  [C0805]
C12  value 0.1 uF  [C0805]
C13  value 0.1 uF  [C0805]
C14  value 0.1 uF  [C0805]
J1  SMD-STRAP_CLOSED  [AP9-00044]  (value not drawn)  (net tie, no BOM)
J2  Erase_Socket  [PIN1]
P5  Header 2  [HDR1X2]
P6  Header 2  [HDR1X2]
U1  ATSAM4N16CA-AU  [LQFP100_N]  (parts A,B of 2)  (net tie)
XC1  12.0MHz  [AP7-00039]

### Ports
AUX_L0 (in), AUX_L1 (in), AUX_L2 (in), AUX_L3 (in), AUX_L4 (in), AUX_L5 (in), AUX_L6 (in), AUX_L7 (in), AUX_R0 (in), AUX_R1 (in), AUX_R2 (in), AUX_R3 (in), AUX_R4 (in), AUX_R5 (in), AUX_R6 (in), AUX_R7 (in), BUTTON_INT (in), CLK_IN (in), CLK_IN_INT (in), CLK_OUT (out), CV_CS1 (out), CV_CS2 (out), DISP_RESET (out), DISP_SEL0 (out), DISP_SEL1 (out), DISP_SEL2 (out), ENC_INT (in), ENC_L0 (in), ENC_L1 (in), ENC_L2 (in), ENC_L3 (in), ENC_L4 (in), ENC_L5 (in), ENC_L6 (in), ENC_L7 (in), ENC_L8 (in), ENC_L9 (in), ENC_L10 (in), ENC_L11 (in), ENC_L12 (in), ENC_L13 (in), ENC_L14 (in), ENC_L15 (in), ENC_R0 (in), ENC_R1 (in), ENC_R2 (in), ENC_R3 (in), ENC_R4 (in), ENC_R5 (in), ENC_R6 (in), ENC_R7 (in), ENC_R8 (in), ENC_R9 (in), ENC_R10 (in), ENC_R11 (in), ENC_R12 (in), ENC_R13 (in), ENC_R14 (in), ENC_R15 (in), GATE1 (out), GATE2 (out), GATE3 (out), GATE4 (out), MOSI (out), NOTE_LEN, NPSC0 (out), NRESET (bidir), PLAY/PAUSE (in), PLAY/PAUSE_LED (out), SCL (out), SDA (bidir), SPCK (out), TCK (bidir), TDI (bidir), TDO (bidir), TMS (bidir)

### Nets
1.27V: C10.2 C11.2 C12.2 C13.2 C14.2 U1.11(VDDOUT) U1.16(VDDCORE) U1.36(VDDCORE) U1.56(VDDCORE) U1.85(VDDCORE) U1.100(VDDPLL)
3.3V: C5.2 C6.2 C7.2 C8.2 C9.2 U1.1(ADVREF) U1.10(VDDIN) U1.27(VDDIO) U1.50(VDDIO) U1.69(VDDIO) U1.91(VDDIO) U1.98(VDDIO)
GND: C3.2 C4.1 C5.1 C6.1 C7.1 C8.1 C9.1 C10.1 C11.1 C12.1 C13.1 C14.1 U1.2(GND) U1.26(GND) U1.45(GND) U1.70(GND) U1.95(GND)
AE_L0: U1.74(PA0/PGMEN0) ; port AUX_L0
AE_L1: U1.52(PA6/PGMNOE) ; port AUX_L1
AE_L2: U1.48(PA8/XOUT32/PGMM0) ; port AUX_L2
AE_L3: U1.28(PA16/PGMD4) ; port AUX_L3
AE_L4: U1.24(PA20/PGMD8/AD3) ; port AUX_L4
AE_L5: U1.20(PA22/PGMD10/AD9) ; port AUX_L5
AE_L6: U1.34(PA24/PGMD12) ; port AUX_L6
AE_L7: U1.39(PA26/PGMD14) ; port AUX_L7
AE_R0: U1.72(PA1/PGMEN1) ; port AUX_R0
AE_R1: U1.49(PA7/XIN32/PGMNVALID) ; port AUX_R1
AE_R2: U1.46(PA9/PGMM1) ; port AUX_R2
AE_R3: U1.12(PA17/PGMD5/AD0) ; port AUX_R3
AE_R4: U1.15(PA21/PGMD9/AD8) ; port AUX_R4
AE_R5: U1.22(PA23/PGMD11) ; port AUX_R5
AE_R6: U1.38(PA25/PGMD13) ; port AUX_R6
AE_R7: U1.57(PA27/PGMD15) ; port AUX_R7
BPM_OUT: U1.41(PA12/PGMD0) ; port CLK_OUT
BPM_TRIG: U1.53(PA5/PGMRDY) ; port CLK_IN
BTN_INT: U1.88(DDM/PB10) ; port BUTTON_INT
CS1: U1.93(PB13/DAC0) ; port CV_CS1
CS2: U1.99(PB14/DAC1) ; port CV_CS2
DISP_RESET: U1.81(PA31) ; port DISP_RESET
DISP_SEL0: U1.59(PA28) ; port DISP_SEL0
DISP_SEL1: U1.63(PA29) ; port DISP_SEL1
DISP_SEL2: U1.64(PA30) ; port DISP_SEL2
ENC_INT: U1.89(DDP/PB11) ; port ENC_INT
GATE_OUT1: U1.3(PB0/AD4) ; port GATE1
GATE_OUT2: U1.5(PB1/AD5) ; port GATE2
GATE_OUT3: U1.7(PB2/AD6) ; port GATE3
GATE_OUT4: U1.9(PB3/AD7) ; port GATE4
JACK_INT: U1.44(PA10/PGMM2) ; port CLK_IN_INT
MOSI: U1.33(PA13/PGMD1) ; port MOSI
NE_L0: U1.25(PC0) ; port ENC_L0
NE_L1: U1.43(PC2) ; port ENC_L1
NE_L2: U1.37(PC4) ; port ENC_L2
NE_L3: U1.32(PC6) ; port ENC_L3
NE_L4: U1.58(PC8) ; port ENC_L4
NE_L5: U1.65(PC10) ; port ENC_L5
NE_L6: U1.23(PC12/AD12) ; port ENC_L6
NE_L7: U1.71(PC14) ; port ENC_L7
NE_L8: U1.73(PC16) ; port ENC_L8
NE_L9: U1.78(PC18) ; port ENC_L9
NE_L10: U1.82(PC20) ; port ENC_L10
NE_L11: U1.86(PC22) ; port ENC_L11
NE_L12: U1.92(p) ; port ENC_L12
NE_L13: U1.13(PC26) ; port ENC_L13
NE_L14: U1.54(PC28) ; port ENC_L14
NE_L15: U1.6(PC30/AD14) ; port ENC_L15
NE_R0: U1.47(PC1) ; port ENC_R0
NE_R1: U1.40(PC3) ; port ENC_R1
NE_R2: U1.35(PC5) ; port ENC_R2
NE_R3: U1.29(PC7) ; port ENC_R3
NE_R4: U1.62(PC9) ; port ENC_R4
NE_R5: U1.68(PC11) ; port ENC_R5
NE_R6: U1.21(PC13/AD10) ; port ENC_R6
NE_R7: U1.19(PC15/AD11) ; port ENC_R7
NE_R8: U1.75(PC17) ; port ENC_R8
NE_R9: U1.80(PC19) ; port ENC_R9
NE_R10: U1.84(PC21) ; port ENC_R10
NE_R11: U1.90(PC23) ; port ENC_R11
NE_R12: U1.94(PC25) ; port ENC_R12
NE_R13: U1.17(PC27) ; port ENC_R13
NE_R14: U1.4(PC29/AD13) ; port ENC_R14
NE_R15: U1.8(PC31) ; port ENC_R15
PLAY/PAUSE_LED: U1.14(PA18/PGMD6/AD1) ; port PLAY/PAUSE_LED
PP_BTN: U1.67(PA2/PGMEN2) ; port PLAY/PAUSE
SCL: U1.55(PA4/PGMNCMD) ; port SCL
SDA: U1.66(PA3) ; port SDA
SPCK: U1.31(PA14/PGMD2) ; port SPCK
NetC3_1: C3.1 C4.2 J1.1 U1.96(PB8/XOUT) U1.97(PB9/PGMCK/XIN) XC1.3
NetJ1_2: J1.2 XC1.1
NetJ2_1: J2.1 U1.87(ERASE/PB12)
NetJ4_2: U1.79(TMS/SWDIO/PB6) ; port TMS
NetJ4_4: U1.83(TCK/SWCLK/PB7) ; port TCK
NetJ4_6: U1.76(TDO/TRACESWO/PB5) ; port TDO
NetJ4_8: U1.51(TDI/PB4) ; port TDI
NetJ4_10: U1.60(NRST) ; port NRESET
NetP5_1: P5.1 P5.2 U1.30(PA15/PGMD3)
NetP6_1: P6.1 U1.61(TST)
NetP6_2: P6.2 U1.77(JTAGSEL)
NetR4_3: U1.18(PA19/PGMD7/AD2) ; port NOTE_LEN
NetU1_42: U1.42(PA11/PGMM3) ; port NPSC0

Not connected (* = marked no-connect by the designer): XC1 2 4

### Notes on the sheet
- NOTE: AUX are encoder pins for non-note encoders
- NOTE: Det cap values for oscillator and remember stray pcb capacitance

### Library data of the parts
C3 C4 = A01-0019: Ceramic capacitor, SMD 0402, NP0, 50V, +/-5%; PartGroup: Capacitors,Ceramic,SMD 0402; TemperatureRange: -55 - +125 deg C; AN: A01-0019; Tolerance: 50V, +/-5%; Height: 0.550000011920929
C5-C14 = Cap: Capacitor; Published: 8-Jun-2000; LatestRevisionDate: 17-Jul-2002; LatestRevisionNote: Re-released for DXP Platform.; PackageReference: RAD-0.3; Publisher: Altium Limited; PackageDescription: Radial Cap, Thru-Hole; 2 Leads; 0.3 in Pin Spacing
J1 = A09-0783: Default closed SMD strap, 0603 size; PartGroup: Mechanical devices,PCB implemented components; Value: SMD-STRAP_0603_CLOSED; AN: A09-0783; Height: 0
J2 = Socket: LatestRevisionDate: 17-Jul-2002; LatestRevisionNote: Re-released for DXP Platform.; Publisher: Altium Limited
P5 P6 = Header 2: Header, 2-Pin; LatestRevisionDate: 17-Jul-2002; LatestRevisionNote: Re-released for DXP Platform.; Publisher: Altium Limited
U1 = ATSAM4S16CA-AU: AT91 ARM Cortex-M4 32-bit Microcontroller, 1MB Flash, 128KB SRAM, USB, 79 User I/Os, 100-Pin LQFP, Industrial Grade (-40°C to 105°C), Pb-Free; DatasheetVersion: revA, Oct-2011; PackageVersion: Apr-2006; PackageReference: LQFP100; PackageDescription: 100-Pin Thin Quad Flat Pack 0.5 mm Pitch; Code_JEDEC: MS-026-BED; ComponentLink1Description: Manufacturer URL; ComponentLink1URL: http://www.atmel.com/; ComponentLink2Description: SAM4S Series Datasheet; ComponentLink2URL: http://www.atmel.com/dyn/resources/prod_documents/11100.pdf; ComponentLink3Description: SAM4S Series Summary; ComponentLink3URL: http://www.atmel.com/dyn/resources/prod_documents/11100S.pdf
XC1 = A07-0042: Fox FQ5032B 12.0MHz SMD crystal 738B-12; PartGroup: Frequency devices,Crystals,SMD; Manufacturer: Fox  Electronics; MPN: FQ5032B-12-C-C-C-200-1; Tolerance: 30PPM; AN: A07-0042; Value: 12.0MHz; Height: 1,20000004768372

## Sheet Buttons.SchDoc
size B
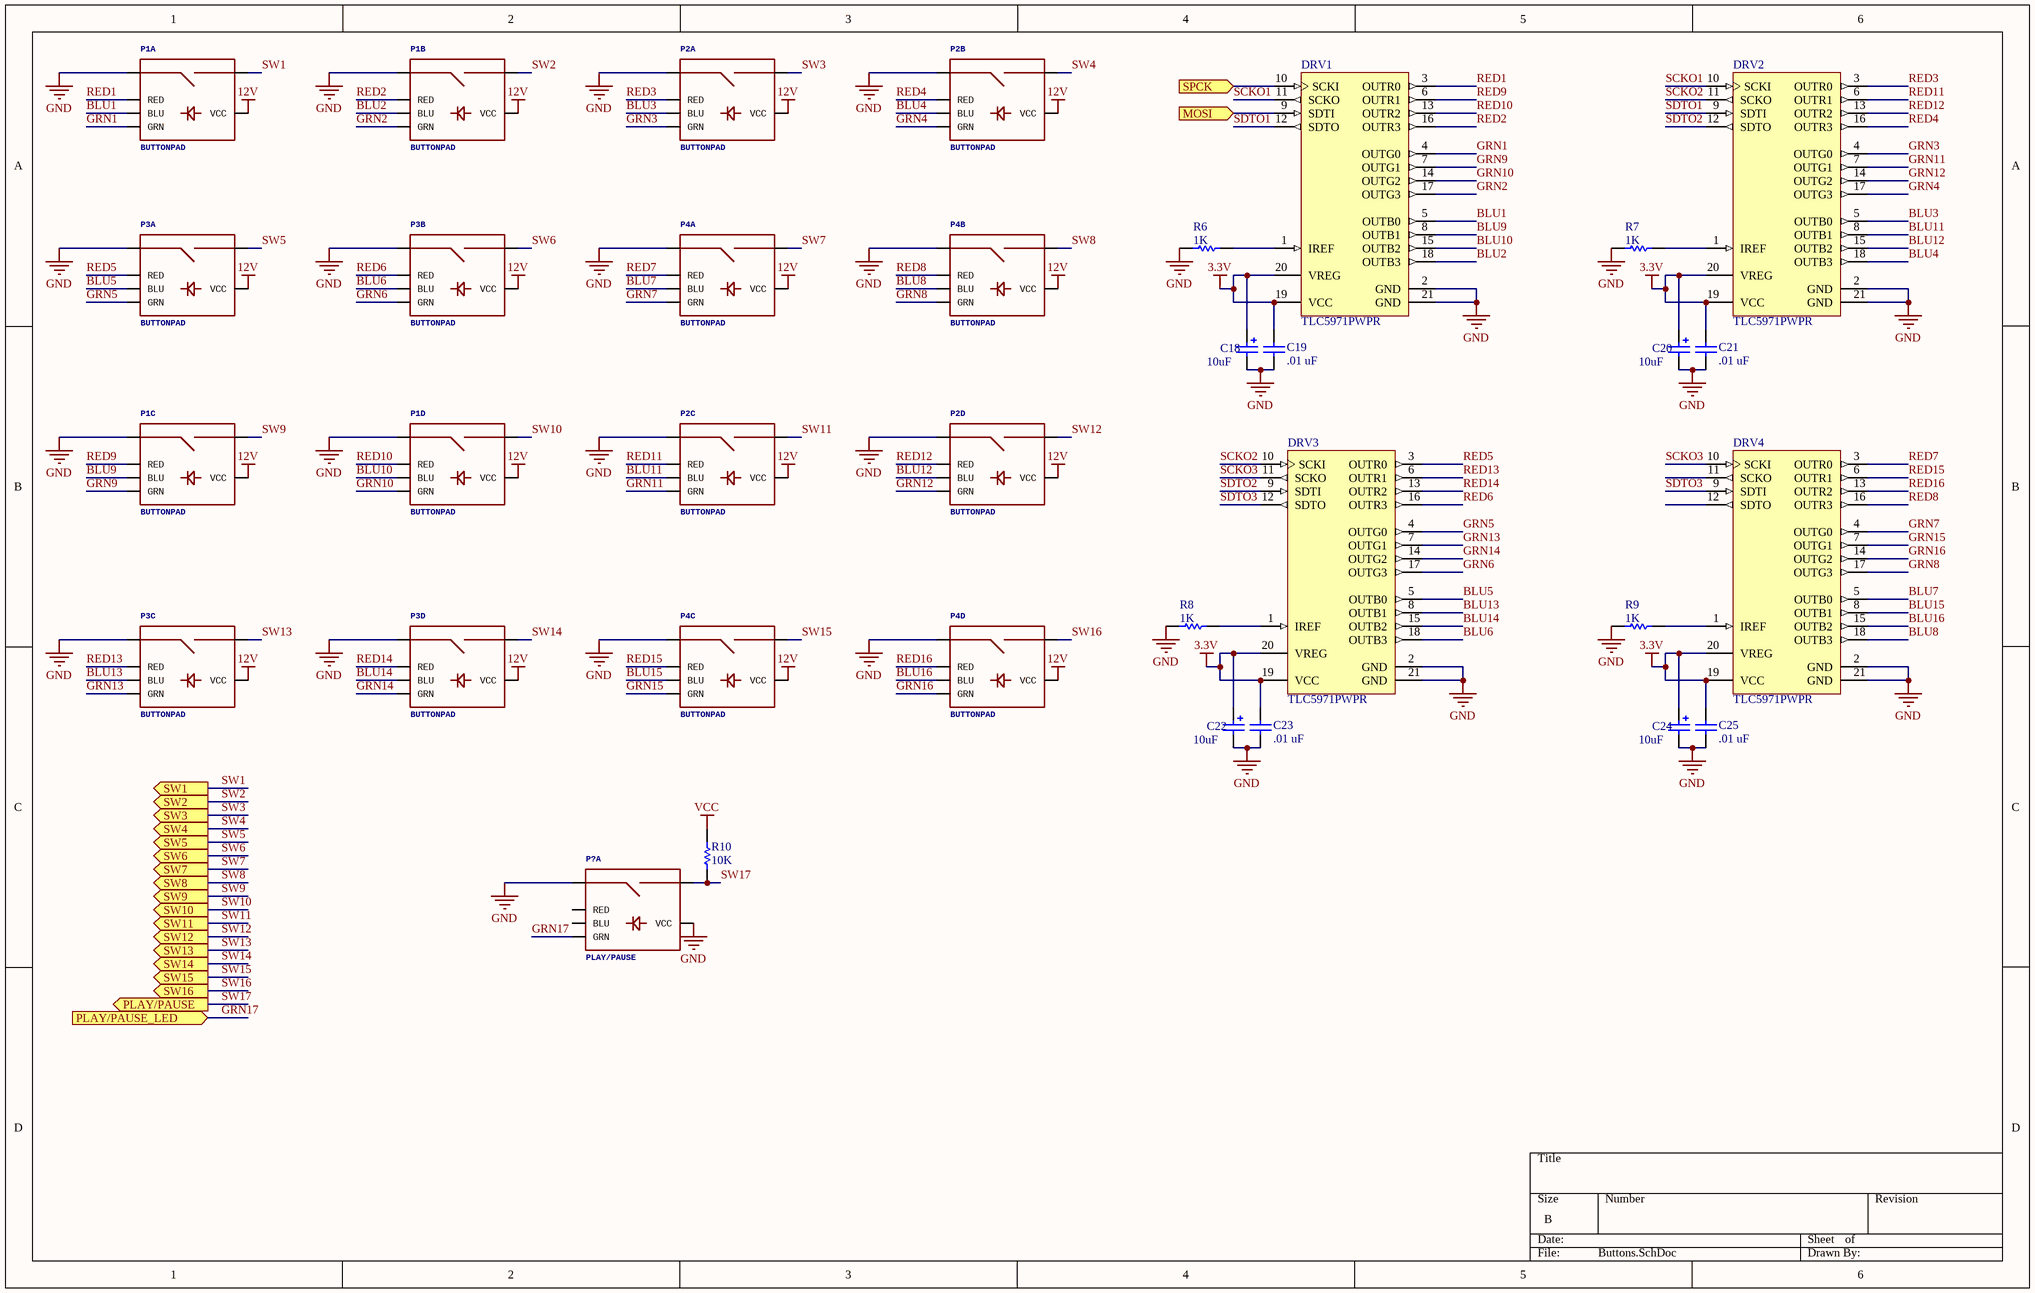
[diagram p5: Buttons.SchDoc]

### Parts
C18  value 10uF  [RAD-0.2]
C19  value .01 uF  [RAD-0.1]  (hidden comment: Cap)
C20  value 10uF  [RAD-0.2]
C21  value .01 uF  [RAD-0.1]  (hidden comment: Cap)
C22  value 10uF  [RAD-0.2]
C23  value .01 uF  [RAD-0.1]  (hidden comment: Cap)
C24  value 10uF  [RAD-0.2]
C25  value .01 uF  [RAD-0.1]  (hidden comment: Cap)
DRV1  TLC5971PWPR  [TI-PWP20-2965X2290TP_N]
DRV2  TLC5971PWPR  [TI-PWP20-2965X2290TP_N]
DRV3  TLC5971PWPR  [TI-PWP20-2965X2290TP_N]
DRV4  TLC5971PWPR  [TI-PWP20-2965X2290TP_N]
P1  BUTTONPAD  [BUTTONPAD-2X2]  (parts A,B,C,D of 4)
P2  BUTTONPAD  [BUTTONPAD-2X2]  (parts A,B,C,D of 4)
P3  BUTTONPAD  [BUTTONPAD-2X2]  (parts A,B,C,D of 4)
P4  BUTTONPAD  [BUTTONPAD-2X2]  (parts A,B,C,D of 4)
P?  PLAY/PAUSE  [BUTTONPAD-1X1]  (part A of 4)
R6  value 1K  [AXIAL-0.3]  (hidden comment: R1)
R7  value 1K  [AXIAL-0.3]  (hidden comment: R2)
R8  value 1K  [AXIAL-0.3]  (hidden comment: R3)
R9  value 1K  [AXIAL-0.3]  (hidden comment: R4)
R10  value 10K  [AXIAL-0.3]  (hidden comment: R3)

### Ports
MOSI (in), PLAY/PAUSE (out), PLAY/PAUSE_LED (in), SPCK (in), SW1 (out), SW2 (out), SW3 (out), SW4 (out), SW5 (out), SW6 (out), SW7 (out), SW8 (out), SW9 (out), SW10 (out), SW11 (out), SW12 (out), SW13 (out), SW14 (out), SW15 (out), SW16 (out)

### Nets
3.3V: C18.1 C19.2 C20.1 C21.2 C22.1 C23.2 C24.1 C25.2 DRV1.19(VCC) DRV1.20(VREG) DRV2.19(VCC) DRV2.20(VREG) DRV3.19(VCC) DRV3.20(VREG) DRV4.19(VCC) DRV4.20(VREG)
12V: P1.VCC1(VCC) P1.VCC2(VCC) P1.VCC3(VCC) P1.VCC4(VCC) P2.VCC1(VCC) P2.VCC2(VCC) P2.VCC3(VCC) P2.VCC4(VCC) P3.VCC1(VCC) P3.VCC2(VCC) P3.VCC3(VCC) P3.VCC4(VCC) P4.VCC1(VCC) P4.VCC2(VCC) P4.VCC3(VCC) P4.VCC4(VCC)
GND: C18.2 C19.1 C20.2 C21.1 C22.2 C23.1 C24.2 C25.1 DRV1.2(GND) DRV1.21(GND) DRV2.2(GND) DRV2.21(GND) DRV3.2(GND) DRV3.21(GND) DRV4.2(GND) DRV4.21(GND) P1.SIG1 P1.SIG3(SIG1) P1.SIG5(SIG1) P1.SIG7(SIG1) P2.SIG1 P2.SIG3(SIG1) P2.SIG5(SIG1) P2.SIG7(SIG1) P3.SIG1 P3.SIG3(SIG1) P3.SIG5(SIG1) P3.SIG7(SIG1) P4.SIG1 P4.SIG3(SIG1) P4.SIG5(SIG1) P4.SIG7(SIG1) P?.SIG1 P?.VCC1(VCC) R6.1 R7.1 R8.1 R9.1
VCC: R10.2
BLU1: DRV1.5(OUTB0) P1.BLU1(BLU)
BLU2: DRV1.18(OUTB3) P1.BLU2(BLU)
BLU3: DRV2.5(OUTB0) P2.BLU1(BLU)
BLU4: DRV2.18(OUTB3) P2.BLU2(BLU)
BLU5: DRV3.5(OUTB0) P3.BLU1(BLU)
BLU6: DRV3.18(OUTB3) P3.BLU2(BLU)
BLU7: DRV4.5(OUTB0) P4.BLU1(BLU)
BLU8: DRV4.18(OUTB3) P4.BLU2(BLU)
BLU9: DRV1.8(OUTB1) P1.BLU3(BLU)
BLU10: DRV1.15(OUTB2) P1.BLU4(BLU)
BLU11: DRV2.8(OUTB1) P2.BLU3(BLU)
BLU12: DRV2.15(OUTB2) P2.BLU4(BLU)
BLU13: DRV3.8(OUTB1) P3.BLU3(BLU)
BLU14: DRV3.15(OUTB2) P3.BLU4(BLU)
BLU15: DRV4.8(OUTB1) P4.BLU3(BLU)
BLU16: DRV4.15(OUTB2) P4.BLU4(BLU)
GRN1: DRV1.4(OUTG0) P1.GRN1(GRN)
GRN2: DRV1.17(OUTG3) P1.GRN2(GRN)
GRN3: DRV2.4(OUTG0) P2.GRN1(GRN)
GRN4: DRV2.17(OUTG3) P2.GRN2(GRN)
GRN5: DRV3.4(OUTG0) P3.GRN1(GRN)
GRN6: DRV3.17(OUTG3) P3.GRN2(GRN)
GRN7: DRV4.4(OUTG0) P4.GRN1(GRN)
GRN8: DRV4.17(OUTG3) P4.GRN2(GRN)
GRN9: DRV1.7(OUTG1) P1.GRN3(GRN)
GRN10: DRV1.14(OUTG2) P1.GRN4(GRN)
GRN11: DRV2.7(OUTG1) P2.GRN3(GRN)
GRN12: DRV2.14(OUTG2) P2.GRN4(GRN)
GRN13: DRV3.7(OUTG1) P3.GRN3(GRN)
GRN14: DRV3.14(OUTG2) P3.GRN4(GRN)
GRN15: DRV4.7(OUTG1) P4.GRN3(GRN)
GRN16: DRV4.14(OUTG2) P4.GRN4(GRN)
GRN17: P?.GRN1(GRN) ; port PLAY/PAUSE_LED
MOSI: DRV1.9(SDTI) ; port MOSI
RED1: DRV1.3(OUTR0) P1.RED1(RED)
RED2: DRV1.16(OUTR3) P1.RED2(RED)
RED3: DRV2.3(OUTR0) P2.RED1(RED)
RED4: DRV2.16(OUTR3) P2.RED2(RED)
RED5: DRV3.3(OUTR0) P3.RED1(RED)
RED6: DRV3.16(OUTR3) P3.RED2(RED)
RED7: DRV4.3(OUTR0) P4.RED1(RED)
RED8: DRV4.16(OUTR3) P4.RED2(RED)
RED9: DRV1.6(OUTR1) P1.RED3(RED)
RED10: DRV1.13(OUTR2) P1.RED4(RED)
RED11: DRV2.6(OUTR1) P2.RED3(RED)
RED12: DRV2.13(OUTR2) P2.RED4(RED)
RED13: DRV3.6(OUTR1) P3.RED3(RED)
RED14: DRV3.13(OUTR2) P3.RED4(RED)
RED15: DRV4.6(OUTR1) P4.RED3(RED)
RED16: DRV4.13(OUTR2) P4.RED4(RED)
SCKO1: DRV1.11(SCKO) DRV2.10(SCKI)
SCKO2: DRV2.11(SCKO) DRV3.10(SCKI)
SCKO3: DRV3.11(SCKO) DRV4.10(SCKI)
SDTO1: DRV1.12(SDTO) DRV2.9(SDTI)
SDTO2: DRV2.12(SDTO) DRV3.9(SDTI)
SDTO3: DRV3.12(SDTO) DRV4.9(SDTI)
SPCK: DRV1.10(SCKI) ; port SPCK
SW1: P1.SIG2 ; port SW1
SW2: P1.SIG4(SIG2) ; port SW2
SW3: P2.SIG2 ; port SW3
SW4: P2.SIG4(SIG2) ; port SW4
SW5: P3.SIG2 ; port SW5
SW6: P3.SIG4(SIG2) ; port SW6
SW7: P4.SIG2 ; port SW7
SW8: P4.SIG4(SIG2) ; port SW8
SW9: P1.SIG6(SIG2) ; port SW9
SW10: P1.SIG8(SIG2) ; port SW10
SW11: P2.SIG6(SIG2) ; port SW11
SW12: P2.SIG8(SIG2) ; port SW12
SW13: P3.SIG6(SIG2) ; port SW13
SW14: P3.SIG8(SIG2) ; port SW14
SW15: P4.SIG6(SIG2) ; port SW15
SW16: P4.SIG8(SIG2) ; port SW16
SW17: P?.SIG2 R10.1 ; port PLAY/PAUSE
NetDRV1_1: DRV1.1(IREF) R6.2
NetDRV2_1: DRV2.1(IREF) R7.2
NetDRV3_1: DRV3.1(IREF) R8.2
NetDRV4_1: DRV4.1(IREF) R9.2

Not connected (* = marked no-connect by the designer): DRV4 11(SCKO) 12(SDTO); P? BLU1(BLU) RED1(RED)

### Library data of the parts
C18 C20 C22 C24 = Cap Pol2: Polarized Capacitor (Axial); Published: 8-Jun-2000; LatestRevisionDate: 17-Jul-2002; LatestRevisionNote: Re-released for DXP Platform.; PackageReference: POLAR0.8; Publisher: Altium Limited; PackageDescription: Polarized Capacitor; 2 Leads
C19 C21 C23 C25 = Cap: Capacitor; Published: 8-Jun-2000; LatestRevisionDate: 17-Jul-2002; LatestRevisionNote: Re-released for DXP Platform.; PackageReference: RAD-0.3; Publisher: Altium Limited; PackageDescription: Radial Cap, Thru-Hole; 2 Leads; 0.3 in Pin Spacing
DRV1-DRV4 = TLC5971PWPR: 12-Channel, 16-Bit ES-PWM RGB LED Driver with 3.3 V Linear Regulator, 6 to 17 V, -40 to 85 degC, 20-pin SOP (PWP20), Green (RoHS & no Sb/Br); Manufacturer: Texas Instruments; Rating: Catalog; Vin(Max)(V): 17; Vin(Min)(V): 6; DatasheetVersion: SBVS146C; PackageVersion: 4073225-4/I; PackageReference: PWP20-2965X2290TP; PackageDescription: 20-Lead, Plastic Small Outline, Body Size 4.4 x 6.5 mm, Pitch 0.65 mm; Supplier 1: Digi-Key; Supplier Part Number 1: 296-27796-2-ND; Supplier 2: Digi-Key; Supplier Part Number 2: 296-27796-1-ND; Supplier 3: Digi-Key; Supplier Part Number 3: 296-27796-6-ND; Supplier 4: Newark; Supplier Part Number 4: 01T0730; Supplier 5: Mouser; Supplier Part Number 5: 595-TLC5971PWPR; Eco-Plan: Green (RoHS & no Sb/Br); SubFamily: LED Driver; Mounting Technology: Surface Mount; Code_JEDEC: MO-153; PartNumber: TLC5971PWPR; ComponentLink1Description: Manufacturer URL; ComponentLink1URL: http://www.ti.com/; ComponentLink2Description: Datasheet; ComponentLink2URL: http://www.ti.com/general/docs/lit/getliterature.tsp?genericPartNumber=TLC5971&fileType=pdf; ComponentLink3Description: Package Specification; ComponentLink3URL: http://www.ti.com/litv/pdf/mhts001g
P1-P4 P? = BUTTONPAD-2X2: 5mm Button PadProven layout and schematic for 2x2 button pad. Panelize this device/fp to a 4x4 pad if needed. Spark Fun Electronics SKU : COM-07835. Compatible common cathode tri-color LED SKU : COM-00105
R6-R10 = Res1: Resistor; Published: 8-Jun-2000; LatestRevisionDate: 17-Jul-2002; LatestRevisionNote: Re-released for DXP Platform.; PackageReference: AXIAL-0.3; Publisher: Altium Limited; PackageDescription: Axial Device, Thru-Hole; 2 Leads; 0.3 in Pin Spacing

## Sheet Jack_In.SchDoc
size Letter
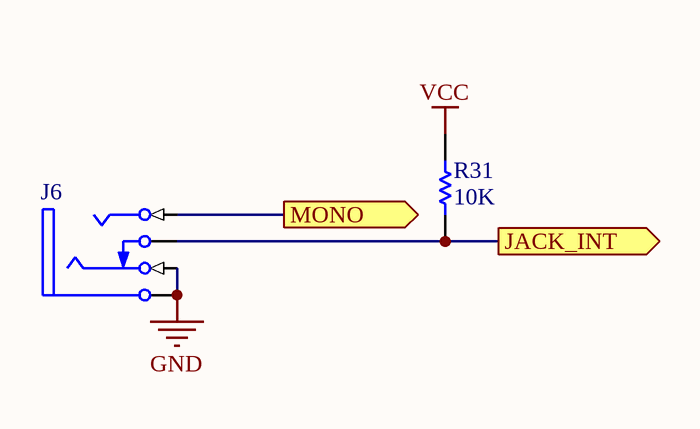
[diagram p6: Jack_In.SchDoc]

### Parts
J6  Phonejack3 RN  [MHDR1X4]  (value not drawn)
R31  value 10K  [AXIAL-0.3]  (hidden comment: Res1)

### Ports
JACK_INT (out), MONO (out)

### Nets
GND: J6.3(R) J6.5(S)
VCC: R31.2
BPM_IN: J6.1(T) ; port MONO
JACK_INT: J6.4(RN) R31.1 ; port JACK_INT

### Library data of the parts
J6 = Phonejack3 RN: Jack Socket, 1/4" [6.5mm], Thru-Hole, Vertical, 3-Conductor with Tip open & Ring closed; PackageDocument: 2003; PCB_Layout: Complies with manufacturer's recommendation.; DrillAndSlotSize: Corresponds to nominal value.; Published: 15-Jul-2004; DatasheetDocument: 2003; PackageReference: S1VS_SBS; Publisher: Altium Limited; ComponentLink1Description: Manufacturer Link; ComponentLink1URL: http://www.cliffuk.co.uk/
R31 = Res1: Resistor; Published: 8-Jun-2000; LatestRevisionDate: 17-Jul-2002; LatestRevisionNote: Re-released for DXP Platform.; PackageReference: AXIAL-0.3; Publisher: Altium Limited; PackageDescription: Axial Device, Thru-Hole; 2 Leads; 0.3 in Pin Spacing

## Sheet Digital_Io.SchDoc
size A
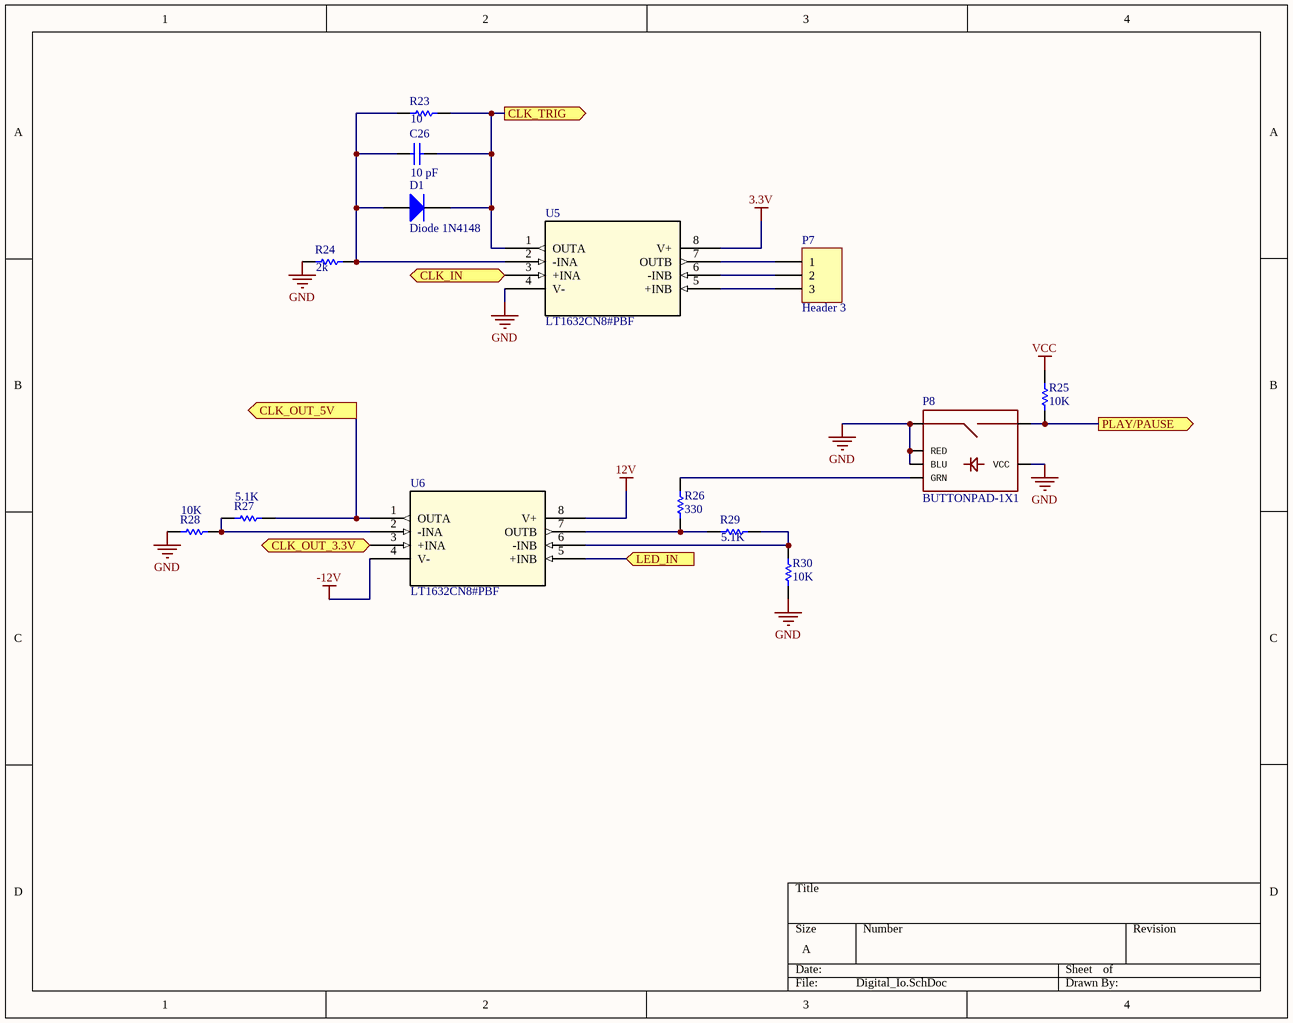
[diagram p7: Digital_Io.SchDoc]

### Parts
(Parts that share a designator on the sheet are numbered #1, #2 ... from top to bottom, then left to right.)
C26  value 10 pF  [C0805]
D1  Diode 1N4148  [DO-35]
P7  Header 3  [HDR1X3]
P8#2  BUTTONPAD-1X1  [BUTTONPAD-1X1]
R23  value 10  [AXIAL-0.3]  (hidden comment: Res1)
R24  value 2k  [AXIAL-0.3]  (hidden comment: Res1)
R25#2  value 10K  [AXIAL-0.3]  (hidden comment: R3)
R26  value 330  [AXIAL-0.3]  (hidden comment: Res1)
R27  value 5.1K  [AXIAL-0.3]  (hidden comment: Res1)
R28  value 10K  [AXIAL-0.3]  (hidden comment: Res1)
R29  value 5.1K  [AXIAL-0.3]  (hidden comment: Res1)
R30  value 10K  [AXIAL-0.3]  (hidden comment: Res1)
U5  LT1632CN8#PBF  [PDIP-8_N]
U6  LT1632CN8#PBF  [PDIP-8_N]

### Ports
CLK_IN (in), CLK_OUT_3.3V (in), CLK_OUT_5V (out), CLK_TRIG (out), LED_IN (in), PLAY/PAUSE (out)

### Nets
3.3V: U5.8(V+)
12V: U6.8(V+)
-12V: U6.4(V-)
GND: P8#2.BLU1(BLU) P8#2.RED1(RED) P8#2.SIG1 P8#2.VCC1(VCC) R24.1 R28.1 R30.1 U5.4(V-)
VCC: R25#2.2
BPM_IN: U5.3(+INA) ; port CLK_IN
BPM_OUT: U6.3(+INA) ; port CLK_OUT_3.3V
BPM_TRIG: C26.1 D1.2(K) R23.2 U5.1(OUTA) ; port CLK_TRIG
CLK OUT: R27.2 U6.1(OUTA) ; port CLK_OUT_5V
PLAY/PAUSE_LED: U6.5(+INB) ; port LED_IN
NetC26_2: C26.2 D1.1(A) R23.1 R24.2 U5.2(-INA)
NetP7_1: P7.1 U5.7(OUTB)
NetP7_2: P7.2 U5.6(-INB)
NetP7_3: P7.3 U5.5(+INB)
NetP8#2_GRN1: P8#2.GRN1(GRN) R26.2
NetP8#2_SIG2: P8#2.SIG2 R25#2.1 ; port PLAY/PAUSE
NetR26_1: R26.1 R29.1 U6.7(OUTB)
NetR27_1: R27.1 R28.2 U6.2(-INA)
NetR29_2: R29.2 R30.2 U6.6(-INB)

### Library data of the parts
C26 = Cap: Capacitor; Published: 8-Jun-2000; LatestRevisionDate: 17-Jul-2002; LatestRevisionNote: Re-released for DXP Platform.; PackageReference: RAD-0.3; Publisher: Altium Limited; PackageDescription: Radial Cap, Thru-Hole; 2 Leads; 0.3 in Pin Spacing
D1 = Diode 1N4148: High Conductance Fast Diode; Published: 8-Jun-2000; LatestRevisionDate: 17-Jul-2002; LatestRevisionNote: Re-released for DXP Platform.; DatasheetVersion: 1997; PackageReference: DO-35; Publisher: Altium Limited; PackageDescription: Diode, Axial; Body 3.8 x 1.9 mm (LxDia. max), Lead Dia. 0.53 mm (max); Code_JEDEC: DO-204-AH; ComponentLink1Description: Manufacturer Link; ComponentLink1URL: http://www.fairchildsemi.com/; ComponentLink2Description: Datasheet; ComponentLink2URL: http://www.fairchildsemi.com/ds/1N%2F1N4148.pdf
P7 = Header 3: Header, 3-Pin; LatestRevisionDate: 17-Jul-2002; LatestRevisionNote: Re-released for DXP Platform.; Publisher: Altium Limited
R23 R24 R25#2 R26-R30 = Res1: Resistor; Published: 8-Jun-2000; LatestRevisionDate: 17-Jul-2002; LatestRevisionNote: Re-released for DXP Platform.; PackageReference: AXIAL-0.3; Publisher: Altium Limited; PackageDescription: Axial Device, Thru-Hole; 2 Leads; 0.3 in Pin Spacing
U5 U6 = LT1632CN8#PBF: as U6 on sheet Gate_Control; -3db_Bandwidth: -; Series: *; Manufacturer_Part_Number: LT1632CN8#PBF; DigiKeyPartNumber: LT1632CN8-ND; Quantity_Available: 0; DataSheet: http://www.linear.com/docs/3055; Packaging: Tube; Package_/_Case: 8-DIP (0.300", 7.62mm); Copyright: Copyright (C) 2015 Accelerated Designs. All rights reserved; Supplier_Device_Package: 8-PDIP; Value: Value; Type: Type; RefDes: RefDes

## Sheet Expanders.SchDoc
size A
Used 2 times, as channels ButtonExpanders, NoteExpanders. Parts and nets are listed once, with the designators drawn on the sheet.
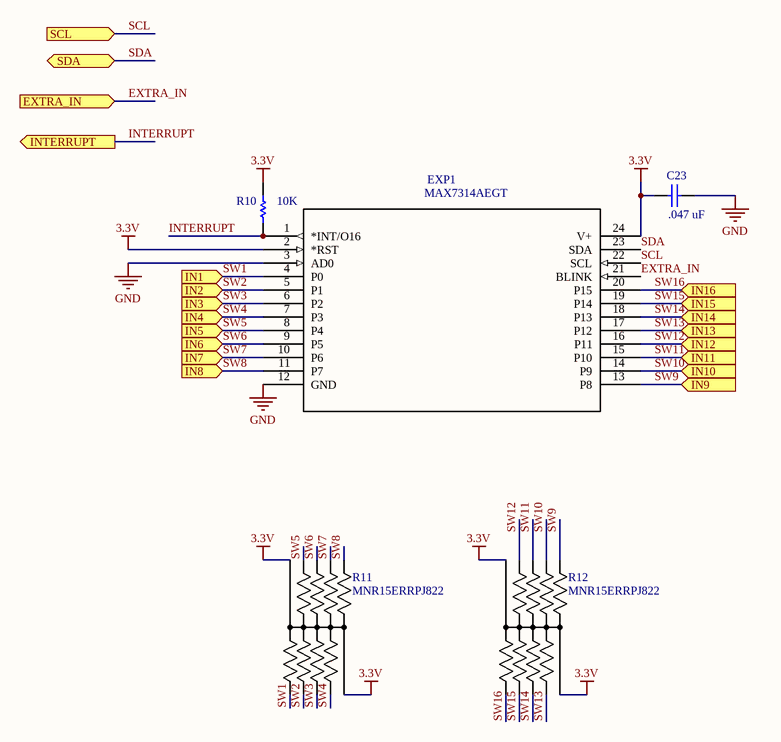
[diagram p8: Expanders.SchDoc]

### Parts
C23  value .047 uF  [RAD-0.1]  (hidden comment: Cap)
EXP1  MAX7314AEGT  [21-0055H_24]
R10  value 10K  [6-0805_N]  (hidden comment: R5)
R11  MNR15ERRPJ822  [MNR15]
R12  MNR15ERRPJ822  [MNR15]

### Ports
EXTRA_IN (in), IN1 (in), IN2 (in), IN3 (in), IN4 (in), IN5 (in), IN6 (in), IN7 (in), IN8 (in), IN9 (in), IN10 (in), IN11 (in), IN12 (in), IN13 (in), IN14 (in), IN15 (in), IN16 (in), INTERRUPT (out), SCL (in), SDA

### Nets
3.3V: C23.1 EXP1.2(*RST) EXP1.24(V+) R10.2 R11.5 R11.10 R12.5 R12.10
GND: C23.2 EXP1.3(AD0) EXP1.12(GND)
EXTRA_IN: EXP1.21(BLINK) ; port EXTRA_IN
INTERRUPT: EXP1.1(*INT/O16) R10.1 ; port INTERRUPT
SCL: EXP1.22(SCL) ; port SCL
SDA: EXP1.23(SDA) ; port SDA
SW1: EXP1.4(P0) R11.1 ; port IN1
SW2: EXP1.5(P1) R11.2 ; port IN2
SW3: EXP1.6(P2) R11.3 ; port IN3
SW4: EXP1.7(P3) R11.4 ; port IN4
SW5: EXP1.8(P4) R11.9 ; port IN5
SW6: EXP1.9(P5) R11.8 ; port IN6
SW7: EXP1.10(P6) R11.7 ; port IN7
SW8: EXP1.11(P7) R11.6 ; port IN8
SW9: EXP1.13(P8) R12.6 ; port IN9
SW10: EXP1.14(P9) R12.7 ; port IN10
SW11: EXP1.15(P10) R12.8 ; port IN11
SW12: EXP1.16(P11) R12.9 ; port IN12
SW13: EXP1.17(P12) R12.4 ; port IN13
SW14: EXP1.18(P13) R12.3 ; port IN14
SW15: EXP1.19(P14) R12.2 ; port IN15
SW16: EXP1.20(P15) R12.1 ; port IN16

### Channels
ButtonExpanders: designators end in _ButtonExpanders; ports EXTRA_IN=EXTRA_IN_ButtonExpanders IN1=SW1 IN2=SW2 IN3=SW3 IN4=SW4 IN5=SW5 IN6=SW6 IN7=SW7 IN8=SW8 IN9=SW9 IN10=SW10 IN11=SW11 IN12=SW12 IN13=SW13 IN14=SW14 IN15=SW15 IN16=SW16 INTERRUPT=BTN_INT SCL=SCL SDA=SDA
NoteExpanders: designators end in _NoteExpanders; ports EXTRA_IN=EXTRA_IN_NoteExpanders IN1=NE_SW0 IN2=NE_SW1 IN3=NE_SW2 IN4=NE_SW3 IN5=NE_SW4 IN6=NE_SW5 IN7=NE_SW6 IN8=NE_SW7 IN9=AE_SW0 IN10=AE_SW1 IN11=AE_SW2 IN12=AE_SW3 IN13=AE_SW4 IN14=AE_SW5 IN15=AE_SW6 IN16=AE_SW7 INTERRUPT=ENC_INT SCL=SCL SDA=SDA

### Library data of the parts
C23 = Cap: Capacitor; Published: 8-Jun-2000; LatestRevisionDate: 17-Jul-2002; LatestRevisionNote: Re-released for DXP Platform.; PackageReference: RAD-0.3; Publisher: Altium Limited; PackageDescription: Radial Cap, Thru-Hole; 2 Leads; 0.3 in Pin Spacing
EXP1 = MAX7314AEGT: Interface IC - I/O extensions Maxim Integrated MAX7314AEG%2B PWM I%C2%B2C 400 kHz QSOP 24; MP: MAX7314AEG+; Availability: Bad; Price: 2.82 USD; MF: Maxim Integrated; Package: QSOP-24 Maxim Integrated; Value: *
R10 = Res1: Resistor; Published: 8-Jun-2000; LatestRevisionDate: 17-Jul-2002; LatestRevisionNote: Re-released for DXP Platform.; PackageReference: AXIAL-0.3; Publisher: Altium Limited; PackageDescription: Axial Device, Thru-Hole; 2 Leads; 0.3 in Pin Spacing
R11 R12 = MNR15ERRPJ822: Imported; Vendor: ROHM; Value: Value; Manufacturer_Part_Number: MNR15ERRPJ822

## Sheet Power.SchDoc
size A
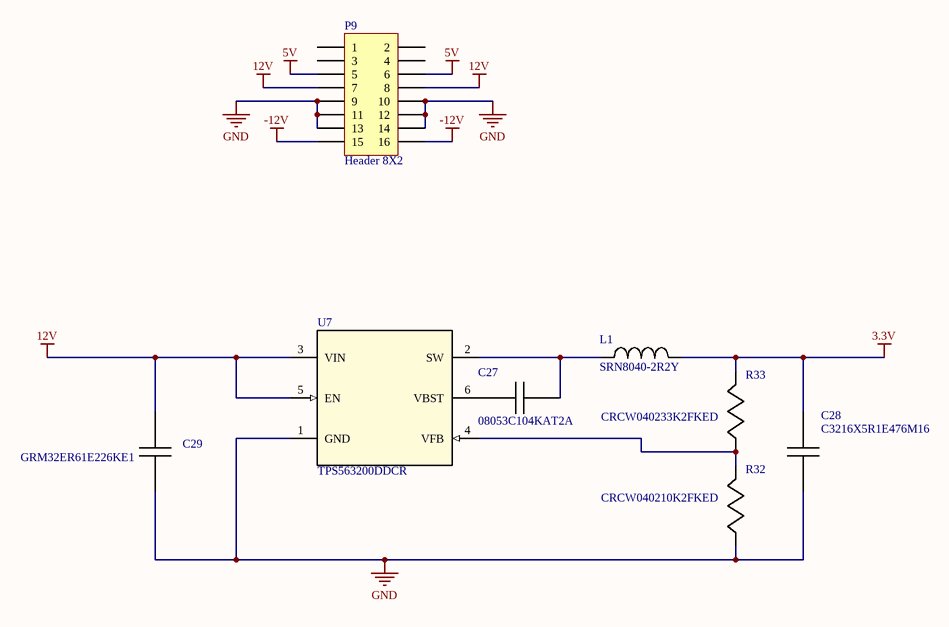
[diagram p9: Power.SchDoc]

### Parts
C27  08053C104KAT2A  [0805]
C28  C3216X5R1E476M16  [1206]
C29  GRM32ER61E226KE1  [1210]
L1  SRN8040-2R2Y  [SRN8040]
P9  Header 8X2  [HDR2X8]
R32  CRCW040210K2FKED  [0402]
R33  CRCW040233K2FKED  [0402]
U7  TPS563200DDCR  [DDC0006A]

### Nets
3.3V: C28.1 L1.2 R33.1
5V: P9.5 P9.6
12V: C29.1 P9.7 P9.8 U7.3(VIN) U7.5(EN)
-12V: P9.15 P9.16
GND: C28.2 C29.2 P9.9 P9.10 P9.11 P9.12 P9.13 P9.14 R32.2 U7.1(GND)
NetC27_1: C27.1 L1.1 U7.2(SW)
NetC27_2: C27.2 U7.6(VBST)
NetR32_1: R32.1 R33.2 U7.4(VFB)

Not connected (* = marked no-connect by the designer): P9 1 2 3 4

### Library data of the parts
C27 = 08053C104KAT2A: Imported; Vendor: AVX; Manufacturer_Part_Number: 08053C104KAT2A; Manufacturer_Name: AVX; RefDes: RefDes; TYPE: TYPE; Value: Value
C28 = C3216X5R1E476M16: Imported; Manufacturer_Part_Number: C3216X5R1E476M160AC; Manufacturer_Name: TDK; Cap_F: 0.000047; VDC_V: 25; RoHS: Y; MountType: SMT; RefDes: RefDes; TYPE: TYPE; Value: Value
C29 = GRM32ER61E226KE1: Imported; Manufacturer_Part_Number: GRM32ER61E226KE15L; Vendor: MuRata; Manufacturer_Name: MuRata; RefDes: RefDes; TYPE: TYPE; Value: Value
L1 = SRN8040-2R2Y: Imported; Vendor: Bourns; Type: DEV; Datasheet_URL: http://www.bourns.com/data/global/pdfs/SRN8040.pdf; Manufacturer_Part_Number: SRN8040-2R2Y; Manufacturer_Name: Bourns; RefDes: RefDes; Value: Value
P9 = Header 8X2: Header, 8-Pin, Dual row; LatestRevisionDate: 17-Jul-2002; LatestRevisionNote: Re-released for DXP Platform.; Publisher: Altium Limited
R32 = CRCW040210K2FKED: Imported; Vendor: Vishay-Dale; Manufacturer_Part_Number: CRCW040210K2FKED; Manufacturer_Name: Vishay-Dale; RefDes: RefDes; TYPE: TYPE; Value: Value
R33 = CRCW040233K2FKED: Imported; Vendor: Vishay-Dale; Manufacturer_Part_Number: CRCW040233K2FKED; Manufacturer_Name: Vishay-Dale; RefDes: RefDes; TYPE: TYPE; Value: Value
U7 = TPS563200DDCR: Imported; Alternate_Manufacturer: None; Manufacturer: Texas Instruments; CurrentTime: Not shown in title block; DocumentNumber: 1; SymbolCreator: a0411947; CompType: IC; U/M: EA; Designator: U?; PIN_COUNT: 6; CurrentDate: Not shown in title block; Time: Not shown in title block; Date: Not shown in title block; DocumentFullPathAndName: Not shown in title block; DocumentName: Not shown in title block; ModifiedDate: Not shown in title block; ApprovedBy: Not shown in title block; CheckedBy: Not shown in title block; Author: Not shown in title block; CompanyName: Not shown in title block; Engineer: Not shown in title block; Organization: Not shown in title block; Address1: Not shown in title block; Address2: Not shown in title block; Address3: Not shown in title block; Address4: Not shown in title block; Revision: Use project parameter SCH_Rev; SheetNumber: 1; SheetTotal: 1; ImagePath: Not shown in title block; Rule: *; ProjectName: *; SymbolVersion: 2014-04-11; PartNumber: TPS563200DDC; PackageReference: DDC0006A; MountType: SMT; ComponentLink1Description: Datasheet Link; ComponentLink1URL: https://sps06.itg.ti.com/sites/KMS/crossdivteams/altium/docs/ComponentDatasheets/TPS56320xDDC_User's_Guide_v0p1_14_0203.pdf; RoHS: Y; Publisher: Texas Instruments; LatestRevisionDate: 2014-04-14; Manufacturer_Part_Number: TPS563200DDCR; Manufacturer_Name: Texas Instruments; RefDes: RefDes; Type: DEV; Value: Value